# EasyEDA Pro project 一键买弹 pcb.epro

# Schematic Schematic1
Assembly Variant: Basic; Board Name: Board1; Create Date: 2026-06-05; Page Name: P1; Project Name: Custom Keyboard; Schematic Name: Schematic1; Update Date: 2026-06-05; Company: 嘉立创EDA; Page Size: A4; Version: V1.0
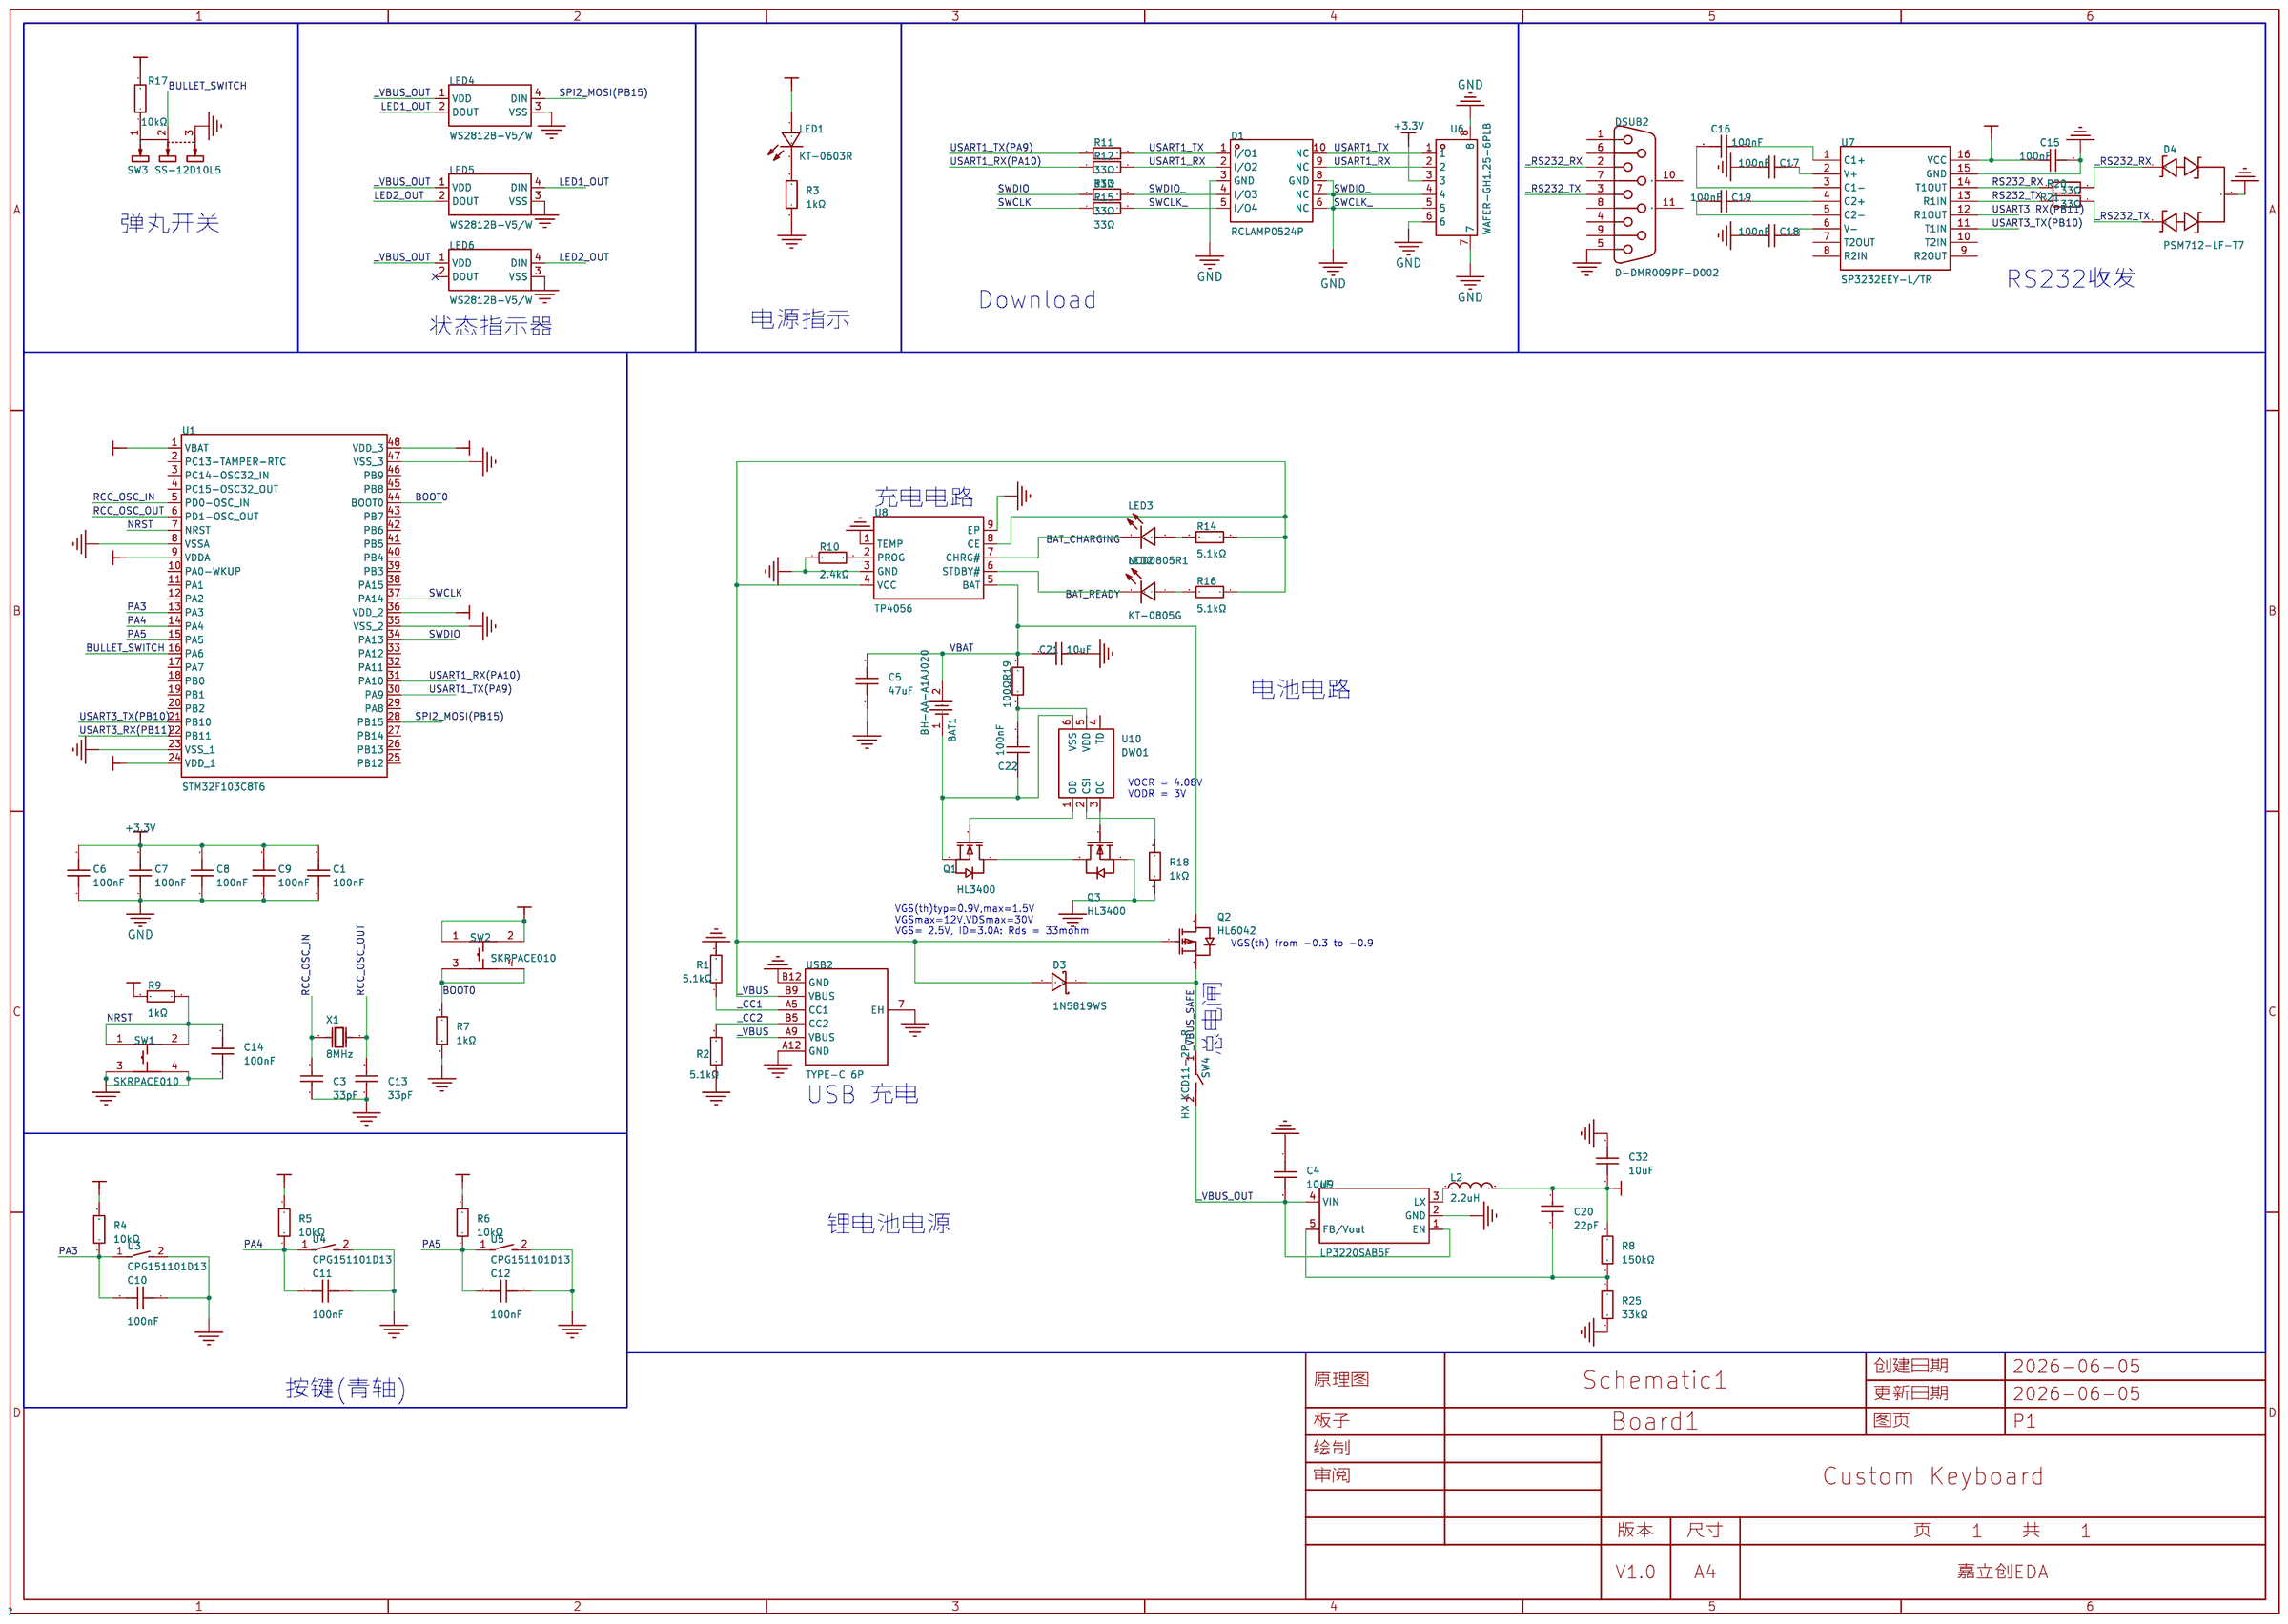
[diagram p0: schematic sheet]

## Parts
BAT1  BH-AA-A1AJ020  [BAT-TH_L56.3-W16.8-P51.55_BH-AA-A1AJ020]
C1  100nF  [C0603]
C3  33pF  [C0603]
C4  10uF  [C0603]
C5  47uF  [C1206]
C6  100nF  [C0603]
C7  100nF  [C0603]
C8  100nF  [C0603]
C9  100nF  [C0603]
C10  100nF  [C0603]
C11  100nF  [C0603]
C12  100nF  [C0603]
C13  33pF  [C0603]
C14  100nF  [C0603]
C15  100nF  [C0603]
C16  100nF  [C0603]
C17  100nF  [C0603]
C18  100nF  [C0603]
C19  100nF  [C0603]
C20  22pF  [C0603]
C21  10uF  [C0603]
C22  100nF  [C0603]
C32  10uF  [C0603]
D1  RCLAMP0524P  [DFN2510-10_L2.5-W1.0-P0.50-BL]
D3  1N5819WS  [SOD-323_L1.8-W1.3-LS2.5-RD]
D4  PSM712-LF-T7  [SOT-23-3_L3.0-W1.7-P0.95-LS2.9-BR]
DSUB2  D-DMR009PF-D002  [DSUB-TH_DMR-9S]
L2  2.2uH  [IND-SMD_L2.5-W2.0_MHCHL2520]
LED1  KT-0603R  [LED-SMD_L1.6-W0.8-R-RD]
LED2  KT-0805G  [LED0805-R-RD]
LED3  NCD0805R1  [LED0805-RD]
LED4  WS2812B-V5/W  [LED-SMD_4P-L5.0-W5.0-TL-1]
LED5  WS2812B-V5/W  [LED-SMD_4P-L5.0-W5.0-TL-1]
LED6  WS2812B-V5/W  [LED-SMD_4P-L5.0-W5.0-TL-1]
Q1  HL3400  [SOT-23-3_L2.9-W1.3-P1.90-LS2.4-BR]
Q2  HL6042  [SOT-23-3_L2.9-W1.4-P1.90-LS2.5-BR]
Q3  HL3400  [SOT-23-3_L2.9-W1.3-P1.90-LS2.4-BR]
R1  5.1kΩ  [R0603]
R2  5.1kΩ  [R0603]
R3  1kΩ  [R0603]
R4  10kΩ  [R0603]
R5  10kΩ  [R0603]
R6  10kΩ  [R0603]
R7  1kΩ  [R0603]
R8  150kΩ  [R0603]
R9  1kΩ  [R0603]
R10  2.4kΩ  [R0603]
R11  33Ω  [R0603]
R12  33Ω  [R0603]
R13  33Ω  [R0603]
R14  5.1kΩ  [R0603]
R15  33Ω  [R0603]
R16  5.1kΩ  [R0603]
R17  10kΩ  [R0603]
R18  1kΩ  [R0603]
R19  100Ω  [R0603]
R20  33Ω  [R0603]
R21  33Ω  [R0603]
R25  33kΩ  [R0603]
SW1  SKRPACE010  [KEY-SMD_4P-L4.2-W3.2-P2.20-LS4.6]
SW2  SKRPACE010  [KEY-SMD_4P-L4.2-W3.2-P2.20-LS4.6]
SW3  SS-12D10L5  [SW-TH_SS-12D10L5]
SW4  HX KCD11-2P-R  [SW-TH_2P-L15.0-W10.5-P5.00_KCD11-2P-R]
U1  STM32F103C8T6  [LQFP-48_L7.0-W7.0-P0.50-LS9.0-BL]
U3  CPG151101D13  [KEY-TH_CPG151101D21X]
U4  CPG151101D13  [KEY-TH_CPG151101D21X]
U5  CPG151101D13  [KEY-TH_CPG151101D21X]
U6  WAFER-GH1.25-6PLB  [CONN-SMD_6P-P1.25_XUNPU_WAFER-GH1.25-6PLB]
U7  SP3232EEY-L/TR  [TSSOP-16_L5.0-W4.4-P0.65-LS6.4-BL]
U8  TP4056  [ESOP-8_L4.9-W3.9-P1.27-LS6.0-BL-EP]
U9  LP3220SAB5F  [SOT-23-5_L3.0-W1.7-P0.95-LS2.8-BR]
U10  DW01  [SOT-23-6_L2.9-W1.6-P0.95-LS2.8-BL]
USB2  TYPE-C 6P  [TYPE-C-SMD_TYPE-C-6P_1]
X1  8MHz  [CRYSTAL-SMD_L5.0-W3.2]

## Library data of the parts
BAT1 = BH-AA-A1AJ020: 加长脚; LCSC Part Name: MYOUNG(美阳)电池盒BH-AA-1J 加长脚DIP 适配5号电池; Supplier Part: C5290181; Manufacturer: MYOUNG(美阳); JLCPCB Part Class: Extended Part; Datasheet: https://item.szlcsc.com/datasheet/BH-AA-A1AJ020/6030887.html; Supplier: LCSC; Type: 电池盒; Operating Temperature: -10~80℃; Contact coating: 镀镍; Applicable battery specifications: 5号
C1 C6-C9 = CC0603KRX7R9BB104: 容值:100nF;精度:±10%;额定电压:50V;材质(温度系数):X7R;; LCSC Part Name: 100nF ±10% 50V; Supplier Part: C14663; Manufacturer: YAGEO(国巨); Supplier Footprint: 0603; JLCPCB Part Class: Basic Part; Datasheet: https://atta.szlcsc.com/upload/public/pdf/source/20180910/C282072_33301C7F631E79921B82A8DAC6BCC5B3.pdf; Supplier: LCSC; Tolerance: ±10%; Voltage Rating: 50V; Temperature Coefficient: X7R; Voltage Rated: 50V
C3 C13 = CL10C330JB8NNNC: 容值:33pF;精度:±5%;额定电压:50V;温度系数:C0G;; LCSC Part Name: 33pF ±5% 50V; Supplier Part: C1663; Manufacturer: SAMSUNG(三星); Supplier Footprint: 0603; JLCPCB Part Class: Basic Part; Datasheet: https://item.szlcsc.com/datasheet/CL10C330JB8NNNC/2015.html; Supplier: LCSC; Tolerance: ±5%; Voltage Rating: 50V; Temperature Coefficient: C0G
C4 C32 = CL10A106MA8NRNC: 容值:10uF;精度:±20%;额定电压:25V;温度系数:X5R;; LCSC Part Name: 10uF ±20% 25V; Supplier Part: C96446; Manufacturer: SAMSUNG(三星); Supplier Footprint: 0603; JLCPCB Part Class: Basic Part; Datasheet: https://item.szlcsc.com/datasheet/CL10A106MA8NRNC/97651.html; Supplier: LCSC; Tolerance: ±20%; Voltage Rating: 25V; Temperature Coefficient: X5R
C5 = CL31A476MPHNNNE: 容值:47uF;精度:±20%;额定电压:10V;温度系数:X5R;; LCSC Part Name: 47uF ±20% 10V; Supplier Part: C96123; Manufacturer: SAMSUNG(三星); Supplier Footprint: 1206; JLCPCB Part Class: Basic Part; Datasheet: https://item.szlcsc.com/datasheet/CL31A476MPHNNNE/97327.html; Supplier: LCSC; Tolerance: ±20%; Voltage Rating: 10V; Temperature Coefficient: X5R
C10-C12 C14-C19 C22 = CC0603KRX7R9BB104: 容值:100nF;精度:±10%;额定电压:50V;温度系数:X7R;; LCSC Part Name: 100nF ±10% 50V; Supplier Part: C14663; Manufacturer: YAGEO(国巨); Supplier Footprint: 0603; JLCPCB Part Class: Basic Part; Datasheet: https://item.szlcsc.com/datasheet/CC0603KRX7R9BB104/15331.html; Supplier: LCSC; Tolerance: ±10%; Voltage Rating: 50V; Temperature Coefficient: X7R
C20 = CL10C220JB8NNNC: 容值:22pF;精度:±5%;额定电压:50V;温度系数:C0G;; LCSC Part Name: 22pF ±5% 50V; Supplier Part: C1653; Manufacturer: SAMSUNG(三星); Supplier Footprint: 0603; JLCPCB Part Class: Basic Part; Datasheet: https://item.szlcsc.com/datasheet/CL10C220JB8NNNC/2005.html; Supplier: LCSC; Tolerance: ±5%; Voltage Rating: 50V; Temperature Coefficient: C0G
C21 = CL10A106KP8NNNC: 容值:10uF;精度:±10%;额定电压:10V;温度系数:X5R;; LCSC Part Name: 10uF ±10% 10V; Supplier Part: C19702; Manufacturer: SAMSUNG(三星); Supplier Footprint: 0603; JLCPCB Part Class: Basic Part; Datasheet: https://item.szlcsc.com/datasheet/CL10A106KP8NNNC/20411.html; Supplier: LCSC; Tolerance: ±10%; Voltage Rating: 10V; Temperature Coefficient: X5R
D1 = RCLAMP0524P_C907837: 极性:单向;反向截止电压(Vrwm):5V;最大钳位电压:17V;峰值脉冲电流(Ipp):4.5A;击穿电压:6.8V;; Supplier Part: C907837; Manufacturer: TECH PUBLIC(台舟); Supplier Footprint: DFN2510-10; JLCPCB Part Class: 扩展库; Datasheet: https://atta.szlcsc.com/upload/public/pdf/source/20210810/AE3DE9AC94AD2A317FD9BEA10653400F.pdf; Supplier: LCSC; polarity: 单向; Reverse Stand-Off Voltage (Vrwm): 5V; Maximum Clamping Voltage: 17V; Peak Pulse Current (Ipp): 4.5A; Breakdown Voltage: 6.8V; Reverse Leakage Current (Ir): 80nA; Number of Lines: 四路; Operating Temperature: -55℃~+125℃; level of protection: IEC 61000-4-2; Type: ESD
D3 = 1N5819WS_C191023: 正向压降(Vf):600mV@1A;直流反向耐压(Vr):40V;整流电流:1A;; LCSC Part Name: 电压:40V 电流:1A; Supplier Part: C191023; Manufacturer: Hottech(合科泰); Supplier Footprint: SOD-323; JLCPCB Part Class: Basic Part; Datasheet: https://item.szlcsc.com/datasheet/1N5819WS/213850.html; Supplier: LCSC; Voltage - Forward(Vf@If): 600mV@1A; Voltage - DC Reverse(Vr): 40V; Current - Rectified: 1A; Non-Repetitive Peak Forward Surge Current: 25A
D4 = PSM712-LF-T7: 极性:单向;反向截止电压(Vrwm):12V;钳位电压:19V;峰值脉冲电流(Ipp):34A@8/20us；30A@8/20us;峰值脉冲功率(Ppp):600W@8/20us;击穿电压(VBR):13.3V;; LCSC Part Name: 单向TVS 12V截止 峰值浪涌电流：34A@8/20us 30A@8/20us; Supplier Part: C32677; Manufacturer: PROTEK; Supplier Footprint: SOT-23; JLCPCB Part Class: Basic Part; Datasheet: https://item.szlcsc.com/datasheet/PSM712-LF-T7/33642.html; Supplier: LCSC; Polarity: 单向; Reverse Stand-Off Voltage (Vrwm): 12V; Clamping Voltage: 19V; Peak Pulse Current (Ipp): 34A@8/20us；30A@8/20us; Peak Pulse Power Dissipation (Ppp): 600W@8/20us; Voltage - Breakdown: 13.3V; Reverse Leakage Current (Ir): 1uA；20uA; Operating Temperature: -55℃~+150℃; level of protection: IEC 61000-4-4；IEC 61000-4-5；IEC 61000-4-2; Type: TVS; Junction Capacitance: 75pF
DSUB2 = D-DMR009PF-D002: 连接器类型:常规D-Sub;公母:母;总PIN位数:9P;安装方式:弯插;排数:2;额定电流-信号脚:3A;工作温度:-45℃~+85℃;; LCSC Part Name: DMR9母; Supplier Part: C141882; Manufacturer: Ckmtw(灿科盟); Supplier Footprint: 弯插; JLCPCB Part Class: Extended Part; Datasheet: https://item.szlcsc.com/datasheet/D-DMR009PF-D002/153213.html; Supplier: LCSC; Connector Type: 常规D-Sub; Gender: 母; Number of Pins: 9P; Mounting Type: 弯插; Number of Rows: 2; Current Rating-Signal: 3A; Color: 黑色; Operating Temperature: -45℃~+85℃
L2 = FTC252012S2R2MBCA: 电感值:2.2uH;精度:±20%;额定电流:3A;饱和电流(Isat):3.8A;类型:一体成型电感;; LCSC Part Name: 2.2uH ±20% 3.8A; Supplier Part: C5832372; Manufacturer: cjiang(长江微电); Supplier Footprint: 1008; JLCPCB Part Class: Extended Part; Datasheet: https://atta.szlcsc.com/upload/public/pdf/source/20230602/8FFEDA9C0247A92A0D4B67554BFE4091.pdf; Supplier: LCSC; Tolerance: ±20%; Rated Current: 3A; Saturation Current (Isat): 3.8A; DC Resistance (DCR): 55mΩ; Type: 一体成型电感
LED1 = KT-0603R: 灯头类型:-;发光颜色:红色;正向压降(Vf):1.8V~2.4V;功率:40mW;正向电流:20mA;波长:615nm~630nm;二极管配置:独立二极管;透镜颜色:无色透明透镜;色温:-;发光强度:300mcd;发光角度:120°;载带方式:-;工作温度:-40℃~+85℃;; LCSC Part Name: 0603 红灯 高亮; Supplier Part: C2286; Manufacturer: KENTO; Supplier Footprint: 0603; JLCPCB Part Class: Basic Part; Datasheet: https://item.szlcsc.com/datasheet/KT-0603R/2659.html; Supplier: LCSC; Illumination Color: 红色; Voltage - Forward(Vf): 1.8V~2.4V; Power(Watts): 40mW; Forward Current: 20mA; Wavelength - Dominant: 615nm~630nm; Peak Wavelength: 645nm; Diode Configuration: 独立二极管; Lens Color: 无色透明透镜; Luminous Intensity: 300mcd; Viewing Angle: 120°; Operating Temperature: -40℃~+85℃
LED2 = KT-0805G: 灯头类型:2mmx1.25mm方形灯头;发光颜色:翠绿色;正向压降(Vf):2.6V~3.1V;功率:100mW;正向电流:5mA;波长:513nm~528nm;二极管配置:独立二极管;透镜颜色:无色透明透镜;色温:-;发光强度:430mcd;发光角度:120°;载带方式:-;工作温度:-40℃~+85℃;; LCSC Part Name: 0805 翠绿 高亮; Supplier Part: C2297; Manufacturer: KENTO; Supplier Footprint: 0805; JLCPCB Part Class: Basic Part; Datasheet: https://item.szlcsc.com/datasheet/KT-0805G/2670.html; Supplier: LCSC; Lamp Holder Type: 2mmx1.25mm方形灯头; Illumination Color: 翠绿色; Voltage - Forward(Vf): 2.6V~3.1V; Power(Watts): 100mW; Forward Current: 5mA; Wavelength - Dominant: 513nm~528nm; Peak Wavelength: 525nm; Diode Configuration: 独立二极管; Lens Color: 无色透明透镜; Luminous Intensity: 430mcd; Viewing Angle: 120°; Operating Temperature: -40℃~+85℃
LED3 = NCD0805R1: 灯头类型:-;发光颜色:红色;正向压降(Vf):1.6V~2.6V;功率:65mW;正向电流:25mA;波长:615nm~630nm;二极管配置:独立二极管;透镜颜色:-;色温:-;发光强度:195mcd;发光角度:130°;载带方式:-;工作温度:-30℃~+85℃;; LCSC Part Name: 片式发光二极管; Supplier Part: C84256; Manufacturer: 国星光电; Supplier Footprint: 0805; JLCPCB Part Class: Basic Part; Datasheet: https://item.szlcsc.com/datasheet/NCD0805R1/85425.html; Supplier: LCSC; Illumination Color: 红色; Voltage - Forward(Vf): 1.6V~2.6V; Power(Watts): 65mW; Forward Current: 25mA; Wavelength - Dominant: 615nm~630nm; Peak Wavelength: 630nm; Diode Configuration: 独立二极管; Luminous Intensity: 195mcd; Viewing Angle: 130°; Operating Temperature: -30℃~+85℃
LED4-LED6 = WS2812B-V5/W: 无需外围元器件，有反接保护和过压保护，游乐设备，消费类电子，电竞领域，电脑周边及设备; LCSC Part Name: RGB三色; Supplier Part: C2874885; Manufacturer: worldsemi; Supplier Footprint: SMD5050; JLCPCB Part Class: Extended Part; Datasheet: https://atta.szlcsc.com/upload/public/pdf/source/20241202/615CE05766148E9C4DD7D8CE8DBC7337.pdf; Supplier: LCSC
Q1 Q3 = HL3400: 数量:1个N沟道;漏源电压(Vdss):30V;连续漏极电流(Id):5.6A;导通电阻(RDS(on)):21mΩ@10V；33mΩ@2.5V；25mΩ@4.5V;耗散功率(Pd):1.2W;阈值电压(Vgs(th)):900mV@250uA;; LCSC Part Name: N-通道,电流:5.6A,耐压:30V; Supplier Part: C22469448; Manufacturer: R+O(宏嘉诚); Supplier Footprint: SOT-23; JLCPCB Part Class: Extended Part; Datasheet: https://item.szlcsc.com/datasheet/HL3400/24180419.html; Supplier: LCSC; Number: 1个N沟道; Drain to Source Voltage: 30V; Current - Continuous Drain(Id): 5.6A; RDS(on): 21mΩ@10V；33mΩ@2.5V；25mΩ@4.5V; Pd - Power Dissipation: 1.2W; Gate Threshold Voltage (Vgs(th)): 900mV@250uA; Gate Charge(Qg): 17nC@10V; Input Capacitance(Ciss): 630pF; Reverse Transfer Capacitance (Crss@Vds): 71pF; Operating Temperature: -55℃~+150℃; Type: N沟道; Output Capacitance(Coss): 90pF
Q2 = HL6042: 数量:1个P沟道;漏源电压(Vdss):20V;连续漏极电流(Id):5A;导通电阻(RDS(on)):43mΩ@4.5V;耗散功率(Pd):1.5W;阈值电压(Vgs(th)):900mV@250uA;; LCSC Part Name: 1个P沟道 耐压:20V 电流:5A; Supplier Part: C28646264; Manufacturer: R+O(宏嘉诚); Supplier Footprint: SOT-23; JLCPCB Part Class: Extended Part; Datasheet: https://item.szlcsc.com/datasheet/HL6042/30381010.html; Supplier: LCSC; Number: 1个P沟道; Drain to Source Voltage: 20V; Current - Continuous Drain(Id): 5A; RDS(on): 43mΩ@4.5V; Pd - Power Dissipation: 1.5W; Gate Threshold Voltage (Vgs(th)): 900mV@250uA; Gate Charge(Qg): 11nC@4.5V; Input Capacitance(Ciss): 905pF; Reverse Transfer Capacitance (Crss@Vds): 115pF; Operating Temperature: -55℃~+150℃; Type: P沟道; Output Capacitance(Coss): 150pF
R1 R2 R14 R16 = 0603WAF5101T5E: 电阻类型:厚膜电阻;阻值:5.1kΩ;精度:±1%;功率:100mW;工作电压:75V;温度系数:±100ppm/℃;; LCSC Part Name: 5.1kΩ ±1% 100mW 厚膜电阻; Supplier Part: C23186; Manufacturer: UNI-ROYAL(厚声); Supplier Footprint: 0603; JLCPCB Part Class: Basic Part; Datasheet: https://item.szlcsc.com/datasheet/0603WAF5101T5E/23913.html; Supplier: LCSC; Type: 厚膜电阻; Tolerance: ±1%; Power(Watts): 100mW; Voltage-Supply(Max): 75V; Temperature Coefficient: ±100ppm/℃; Operating Temperature: -55℃~+155℃
R3 R7 R9 R18 = 0603WAF1001T5E: 电阻类型:厚膜电阻;阻值:1kΩ;精度:±1%;功率:100mW;最大工作电压:75V;温度系数:±100ppm/℃;; LCSC Part Name: 1kΩ ±1% 100mW 厚膜电阻; Supplier Part: C21190; Manufacturer: UNI-ROYAL(厚声); Supplier Footprint: 0603; JLCPCB Part Class: Basic Part; Datasheet: https://atta.szlcsc.com/upload/public/pdf/source/20200306/C422600_1E6D84923E4A46A82E41ADD87F860B5C.pdf; Supplier: LCSC; Type: 厚膜电阻; Tolerance: ±1%; Power(Watts): 100mW; Overload Voltage (Max): 75V; Temperature Coefficient: ±100ppm/℃; Operating Temperature Range: -55℃~+155℃
R4-R6 R17 = 0603WAF1002T5E: 电阻类型:厚膜电阻;阻值:10kΩ;精度:±1%;功率:100mW;工作电压:75V;温度系数:±100ppm/℃;; LCSC Part Name: 厚膜电阻 10kΩ ±1% 100mW; Supplier Part: C25804; Manufacturer: UNI-ROYAL(厚声); Supplier Footprint: 0603; JLCPCB Part Class: Basic Part; Datasheet: https://item.szlcsc.com/datasheet/0603WAF1002T5E/26547.html; Supplier: LCSC; Type: 厚膜电阻; Tolerance: ±1%; Power(Watts): 100mW; Voltage-Supply(Max): 75V; Temperature Coefficient: ±100ppm/℃; Operating Temperature: -55℃~+155℃
R8 = 0603WAF1503T5E: 电阻类型:厚膜电阻;阻值:150kΩ;精度:±1%;功率:100mW;工作电压:75V;温度系数:±100ppm/℃;; LCSC Part Name: 150kΩ ±1% 100mW 厚膜电阻; Supplier Part: C22807; Manufacturer: UNI-ROYAL(厚声); Supplier Footprint: 0603; JLCPCB Part Class: Basic Part; Datasheet: https://item.szlcsc.com/datasheet/0603WAF1503T5E/23534.html; Supplier: LCSC; Type: 厚膜电阻; Tolerance: ±1%; Power(Watts): 100mW; Voltage-Supply(Max): 75V; Temperature Coefficient: ±100ppm/℃; Operating Temperature: -55℃~+155℃
R10 = 0603WAF2401T5E: 电阻类型:厚膜电阻;阻值:2.4kΩ;精度:±1%;功率:100mW;工作电压:75V;温度系数:±100ppm/℃;; LCSC Part Name: 2.4kΩ ±1% 100mW 厚膜电阻; Supplier Part: C22940; Manufacturer: UNI-ROYAL(厚声); Supplier Footprint: 0603; JLCPCB Part Class: Basic Part; Datasheet: https://item.szlcsc.com/datasheet/0603WAF2401T5E/23667.html; Supplier: LCSC; Type: 厚膜电阻; Tolerance: ±1%; Power(Watts): 100mW; Voltage-Supply(Max): 75V; Temperature Coefficient: ±100ppm/℃; Operating Temperature: -55℃~+155℃
R11-R13 R15 R20 R21 = 0603WAF330JT5E: 电阻类型:厚膜电阻;阻值:33Ω;精度:±1%;功率:100mW;工作电压:75V;温度系数:±100ppm/℃;; LCSC Part Name: 33Ω ±1% 100mW 厚膜电阻; Supplier Part: C23140; Manufacturer: UNI-ROYAL(厚声); Supplier Footprint: 0603; JLCPCB Part Class: Basic Part; Datasheet: https://item.szlcsc.com/datasheet/0603WAF330JT5E/23867.html; Supplier: LCSC; Type: 厚膜电阻; Tolerance: ±1%; Power(Watts): 100mW; Voltage-Supply(Max): 75V; Temperature Coefficient: ±100ppm/℃; Operating Temperature: -55℃~+155℃
R19 = 0603WAF1000T5E: 电阻类型:厚膜电阻;阻值:100Ω;精度:±1%;功率:100mW;最大工作电压:75V;温度系数:±200ppm/℃;; LCSC Part Name: 100Ω ±1% 100mW 厚膜电阻; Supplier Part: C22775; Manufacturer: UNI-ROYAL(厚声); Supplier Footprint: 0603; JLCPCB Part Class: Basic Part; Datasheet: https://atta.szlcsc.com/upload/public/pdf/source/20200306/C422600_1E6D84923E4A46A82E41ADD87F860B5C.pdf; Supplier: LCSC; Type: 厚膜电阻; Tolerance: ±1%; Power(Watts): 100mW; Overload Voltage (Max): 75V; Temperature Coefficient: ±200ppm/℃; Operating Temperature Range: -55℃~+155℃
R25 = 0603WAF3302T5E: 电阻类型:厚膜电阻;阻值:33kΩ;精度:±1%;功率:100mW;工作电压:75V;温度系数:±100ppm/℃;; LCSC Part Name: 33kΩ ±1% 100mW 厚膜电阻; Supplier Part: C4216; Manufacturer: UNI-ROYAL(厚声); Supplier Footprint: 0603; JLCPCB Part Class: Basic Part; Datasheet: https://item.szlcsc.com/datasheet/0603WAF3302T5E/4623.html; Supplier: LCSC; Type: 厚膜电阻; Tolerance: ±1%; Power(Watts): 100mW; Voltage-Supply(Max): 75V; Temperature Coefficient: ±100ppm/℃; Operating Temperature: -55℃~+155℃
SW1 SW2 = SKRPACE010: 电路结构:单刀单掷;按钮形状:椭圆形按钮;安装方式:立贴;开关长度:4.2mm;开关宽度:3.2mm;开关高度:2.5mm;触点电流:50mA;额定电压:16V;带灯:-;工作寿命:-;; LCSC Part Name: 4.2*3.2*2.5mm 立贴 轻触开关; Supplier Part: C139797; Manufacturer: ALPSALPINE(阿尔卑斯阿尔派); Supplier Footprint: SMD-4P,4.2x3.2mm; JLCPCB Part Class: Extended Part; Datasheet: https://item.szlcsc.com/datasheet/SKRPACE010/151122.html; Supplier: LCSC; Circuit: 单刀单掷; Actuator Style: 椭圆形按钮; Mounting Type: 立贴; Length: 4.2mm; Width: 3.2mm; Switch Height: 2.5mm; Contact Current: 50mA; Voltage Rating: 16V
SW3 = SS-12D10L5: 电路结构:单刀双掷;安装方式:直插;开关颜色:黑色;额定电流:3A;额定电压:125V;工作寿命:1万次;; LCSC Part Name: 柄长5mm 直插双档 滑动开关; Supplier Part: C319012; Manufacturer: XKB Connection(中国星坤); Supplier Footprint: 插件,13x6.8mm; JLCPCB Part Class: Extended Part; Datasheet: https://item.szlcsc.com/datasheet/SS-12D10L5/300104.html; Supplier: LCSC; Circuit: 单刀双掷; Actuator Style: 矩形柱状; Termination Style: PC引脚; Length: 13mm; Width: 6.8mm; Switch Height: 6.4mm; Mounting Type: 直插; Actuator Color: 黑色; Current Rating: 3A; Voltage Rating: 125V; Life: 1万次; Operating Temperature: -40℃~+85℃
SW4 = HX KCD11-2P-R: 带灯:无;引脚样式:焊片;额定电流:3A;额定电压(AC):250V;电路结构:单刀单掷;工作寿命:1万次;; LCSC Part Name: 10.5*15mm 两脚两档跷板开关 红钮; Supplier Part: C6917318; Manufacturer: hanxia(韩下); Supplier Footprint: 插件; JLCPCB Part Class: Extended Part; Datasheet: https://item.szlcsc.com/datasheet/HX%2520KCD11-2P-R/7881930.html; Supplier: LCSC; With Lamp: 无; Termination Style: 焊片; Actuator Color: 红色; Current Rating: 3A; Voltage Rating (AC): 250V; Circuit: 单刀单掷; Life: 1万次
U1 = STM32F103C8T6: CPU内核:ARM-M3;CPU最大主频:72MHz;应用领域:-;; LCSC Part Name: 主流增强型ARM Cortex-M3 MCU，具有64 KB Flash、72 MHz CPU、电机控制、USB和CAN; Supplier Part: C8734; Manufacturer: ST(意法半导体); Supplier Footprint: LQFP-48(7x7); JLCPCB Part Class: Extended Part; Datasheet: https://item.szlcsc.com/datasheet/STM32F103C8T6/9243.html; Supplier: LCSC; CPU Core: ARM-M3; CPU Maximum Speed: 72MHz; Program Storage Size: 64KB; Program Memory Type: FLASH; Number of I/O: 37; ADC (Bit): 12bit; Voltage - Supply: 2V~3.6V
U3-U5 = CPG151101D13: 轴类型:青轴;作用力:50gf;; LCSC Part Name: 青轴; Supplier Part: C49234235; Manufacturer: HanElectricity(瀚源); Supplier Footprint: 插件; JLCPCB Part Class: Extended Part; Datasheet: https://item.szlcsc.com/datasheet/CPG151101D13/51650377.html; Supplier: LCSC; Axis Type: 青轴; Operation Force: 50gf; Conduction Travel: 2.2mm; Voltage Rating: 12V; Operating Temperature: -40℃~+70℃
U6 = WAFER-GH1.25-6PLB: 插针结构:1x6P;间距:1.25mm;安装方式:立贴;参考系列:GH;总PIN数:6P;排数:1;每排PIN数:6;额定电流:1A;工作温度范围:-25℃~+85℃;; LCSC Part Name: 1x6P 间距:1.25mm 立贴 系列:GH; Supplier Part: C3029372; Manufacturer: XUNPU(讯普); Supplier Footprint: SMD,P=1.25mm; JLCPCB Part Class: 扩展库; Datasheet: https://atta.szlcsc.com/upload/public/pdf/source/20220527/44F824AAC8C2B617205E15955FF9C23D.pdf; Supplier: LCSC; Pins Structure: 1x6P; Pitch: 1.25mm; Mounting Style: 立贴; Reference Series: GH; Number of Pins: 6P; Number of Rows: 1; Number of PINs Per Row: 6; Current Rating (Max): 1A; Operating Temperature Range: -25℃~+85℃
U7 = SP3232EEY-L/TR: 类型:收发器;数据速率:235Kbps;; LCSC Part Name: True3.0V至5.5V RS-232收发器; Supplier Part: C13482; Manufacturer: MaxLinear(迈凌); Supplier Footprint: TSSOP-16; JLCPCB Part Class: Basic Part; Datasheet: https://item.szlcsc.com/datasheet/SP3232EEY-L%252FTR/14131.html; Supplier: LCSC; Type: 收发器; Number of Drivers: 2; Number of Receivers: 2; Data Rate: 235Kbps; Voltage - Supply: 3V~5.5V; ESD Protect: ±15kV; charge pump: 有; Operating Temperature: -40℃~+85℃
U8 = TP4056_C725790: 工作电压:4V~6.5V;最大充电电流:1A;电池类型:锂电池;电池节数:1;; LCSC Part Name: 1A独立式线性锂离子电池充电器; Supplier Part: C725790; Manufacturer: UMW(友台半导体); Supplier Footprint: ESOP-8; JLCPCB Part Class: Extended Part; Datasheet: https://item.szlcsc.com/datasheet/TP4056/772193.html; Supplier: LCSC; The Chip Type: 充电芯片; Voltage - Supply: 4V~6.5V; Charge Current - Max: 1A; Charging Saturation Voltage: 4.2V; Type of Battery: 锂电池; Number of Cells: 1; Operating Temperature: -40℃~+85℃; Battery Temperature Detection: 支持; 0V Battery Charge: 支持; Supply Current (Iq): 35uA; Features: 恒压充电；恒流充电；自动再充电；充电终止；软启动；可编程充电电流；欠压锁定；涓流充电
U9 = LP3220SAB5F: 功能类型:降压型;工作电压:2.2V~5.5V;输出电压:610mV~5.5V;输出电流:1A;输出类型:可调;; LCSC Part Name: 降压型 1A 2.2V~5.5V; Supplier Part: C517212; Manufacturer: LOWPOWER(微源半导体); Supplier Footprint: SOT-23-5; JLCPCB Part Class: Extended Part; Datasheet: https://item.szlcsc.com/datasheet/LP3220SAB5F/533577.html; Supplier: LCSC; Function: 降压型; Voltage - Supply: 2.2V~5.5V; Output Voltage: 610mV~5.5V; Output Current: 1A; Frequency - Switching: 1.5MHz; Operating Temperature: -40℃~+85℃@(TA); Synchronous Rectifier: 是; Number of Outputs: 1; Topology: 降压式; Quiescent Current: 70uA; Switch tube (built-in/external): 内置; Output Type: 可调; Features: 逐波限流；过流保护
U10 = DW01_C917079: 工作电压:1.5V~8V;最大充电电流:-;电池类型:锂电池;电池节数:1;; LCSC Part Name: 锂离子/锂聚合物电池保护IC; Supplier Part: C917079; Manufacturer: JSMSEMI(杰盛微); Supplier Footprint: SOT-23-6; JLCPCB Part Class: Extended Part; Datasheet: https://item.szlcsc.com/datasheet/DW01/991575.html; Supplier: LCSC; The Chip Type: 保护芯片; Voltage - Supply: 1.5V~8V; Charging Saturation Voltage: 4.28V; End-Off Voltage: 2.4V; Type of Battery: 锂电池; Number of Cells: 1; Operating Temperature: -40℃~+85℃; Battery Temperature Detection: 不支持; 0V Battery Charge: 支持; Supply Current (Iq): 4uA
USB2 = TYPE-C 6P: 连接器类型:Type-C;协议标准:-;公母:母;安装方式:卧贴;触点数量:6P;端口数量:1;额定电流 - 电源:3A;工作温度:-40℃~+85℃;; LCSC Part Name: 6P卧贴母座; Supplier Part: C456012; Manufacturer: SHOU HAN(首韩); Supplier Footprint: SMD; JLCPCB Part Class: Extended Part; Datasheet: https://item.szlcsc.com/datasheet/TYPE-C%25206P/458819.html; Supplier: LCSC; Connector Type: Type-C; Gender: 母; Mounting Type: 卧贴; Number of Contacts: 6P; Number of Ports: 1; Current Rating-Power: 3A; Voltage Rating: 5V; Connect-Disconnect Life: 3千次; Detection color: 黑色; Operating Temperature: -40℃~+85℃
X1 = X50328MSB2GI: 晶振类型:贴片晶振;频率:8MHz;常温频差:±10ppm;负载电容:20pF;频率稳定度:±20ppm;; LCSC Part Name: YSX530GA 8MHZ 2P 5032 20PF ±10PPM -40~85℃ (±20PPM); Supplier Part: C115962; Manufacturer: YXC(扬兴晶振); Supplier Footprint: SMD5032-2P; JLCPCB Part Class: Basic Part; Datasheet: https://item.szlcsc.com/datasheet/X50328MSB2GI/117214.html; Supplier: LCSC; Type: 贴片晶振; Normal temperature Frequency Tolerance: ±10ppm; Load Capacitance: 20pF; Frequency Stability: ±20ppm; Operating Temperature: -40℃~+85℃

## Nets
+3.3V: C1.2 C6.2 C7.2 C8.2 C9.2 C15.1 C20.1 C32.2 L2.2 LED1.1(A) R4.2 R5.2 R6.2 R8.1 R9.2 R17.2 SW2.1 SW2.2 U1.1(VBAT) U1.9(VDDA) U1.24(VDD_1) U1.36(VDD_2) U1.48(VDD_3) U6.3 U7.16(VCC)
GND: C1.1 C3.1 C4.1 C5.1 C6.1 C7.1 C8.1 C9.1 C10.1 C11.1 C12.1 C13.1 C14.1 C15.2 C17.1 C18.1 C21.1 C32.1 D1.3(GND) D1.8(GND) D4.3(K) DSUB2.5 LED4.3(VSS) LED5.3(VSS) LED6.3(VSS) Q3.2(S) R1.2 R2.1 R3.1 R7.2 R10.1 R18.1 R25.2 SW1.3 SW1.4 SW3.3 U1.8(VSSA) U1.23(VSS_1) U1.35(VSS_2) U1.47(VSS_3) U3.2 U4.2 U5.2 U6.6 U6.7 U6.8 U7.15(GND) U8.1(TEMP) U8.3(GND) U8.9(EP) U9.2(GND) USB2.7(EH) USB2.A12(GND) USB2.B12(GND)
VBAT: BAT1.2 C5.2 C21.2 Q2.3(D) R19.1 U8.5(BAT)
_CC1: R1.1 USB2.A5(CC1)
_CC2: R2.2 USB2.B5(CC2)
_RS232_RX: D4.1(A1) DSUB2.2 R20.2
_RS232_TX: D4.2(A1) DSUB2.3 R21.2
_VBUS: D3.2(A) Q2.1(G) R14.1 R16.1 U8.4(VCC) U8.8(CE) USB2.A9(VBUS) USB2.B9(VBUS)
_VBUS_OUT: C4.2 LED4.1(VDD) LED5.1(VDD) LED6.1(VDD) SW4.2 U9.1(EN) U9.4(VIN)
_VBUS_SAFE: D3.1(K) Q2.2(S) SW4.1
BAT_CHARGING: LED3.1(-) U8.7(CHRG#)
BAT_READY: LED2.2(K) U8.6(STDBY#)
BOOT0: R7.1 SW2.3 SW2.4 U1.44(BOOT0)
BULLET_SWITCH: SW3.2 U1.16(PA6)
LED1_OUT: LED4.2(DOUT) LED5.4(DIN)
LED2_OUT: LED5.2(DOUT) LED6.4(DIN)
NRST: C14.2 R9.1 SW1.1 SW1.2 U1.7(NRST)
PA3: C10.2 R4.1 U1.13(PA3) U3.1
PA4: C11.2 R5.1 U1.14(PA4) U4.1
PA5: C12.2 R6.1 U1.15(PA5) U5.1
RCC_OSC_IN: C3.2 U1.5(PD0-OSC_IN) X1.2(OSC2)
RCC_OSC_OUT: C13.2 U1.6(PD1-OSC_OUT) X1.1(OSC1)
RS232_RX: R20.1 U7.14(T1OUT)
RS232_TX: R21.1 U7.13(R1IN)
SPI2_MOSI(PB15): LED4.4(DIN) U1.28(PB15)
SWCLK: R15.1 U1.37(PA14)
SWCLK_: D1.5(I/O4) D1.6(NC) R15.2 U6.5
SWDIO: R13.1 U1.34(PA13)
SWDIO_: D1.4(I/O3) D1.7(NC) R13.2 U6.4
USART1_RX: D1.2(I/O2) D1.9(NC) R12.2 U6.2
USART1_RX(PA10): R12.1 U1.31(PA10)
USART1_TX: D1.1(I/O1) D1.10(NC) R11.2 U6.1
USART1_TX(PA9): R11.1 U1.30(PA9)
USART3_RX(PB11): U1.22(PB11) U7.12(R1OUT)
USART3_TX(PB10): U1.21(PB10) U7.11(T1IN)
$1N16: LED1.2(K) R3.2
$1N89: C16.1 U7.1(C1+)
$1N90: C16.2 U7.3(C1-)
$1N91: C17.2 U7.2(V+)
$1N93: C18.2 U7.6(V-)
$1N102: C19.2 U7.4(C2+)
$1N103: C19.1 U7.5(C2-)
$1N132: R10.2 U8.2(PROG)
$1N134: LED3.2(+) R14.2
$1N138: LED2.1(A) R16.2
$1N157: R17.1 SW3.1
$1N185: R18.2 U10.2(CSI)
$1N186: Q1.1(G) U10.1(OD)
$1N187: Q3.1(G) U10.3(OC)
$1N188: Q1.3(D) Q3.3(D)
$1N233: L2.1 U9.3(LX)
$1N234: C20.2 R8.2 R25.1 U9.5(FB/Vout)
$1N238: C22.2 R19.2 U10.5(VDD)
$1N240: BAT1.1 C22.1 Q1.2(S) U10.6(VSS)

Not connected (* = marked no-connect by the designer): DSUB2 1 4 6 7 8 9 10(MH1) 11(MH2); LED6 2(DOUT)*; U1 2(PC13-TAMPER-RTC) 3(PC14-OSC32_IN) 4(PC15-OSC32_OUT) 10(PA0-WKUP) 11(PA1) 12(PA2) 17(PA7) 18(PB0) 19(PB1) 20(PB2) 25(PB12) 26(PB13) 27(PB14) 29(PA8) 32(PA11) 33(PA12) 38(PA15) 39(PB3) 40(PB4) 41(PB5) 42(PB6) 43(PB7) 45(PB8) 46(PB9); U7 7(T2OUT) 8(R2IN) 9(R2OUT) 10(T2IN); U10 4(TD)

## Notes on the sheet
- 弹丸开关
- RS232收发
- Download
- 状态指示器
- 电源指示
- 充电电路
- 电池电路
- VOCR = 4.08V
  VODR = 3V
- VGS(th)typ=0.9V,max=1.5V
  VGSmax=12V,VDSmax=30V
  VGS= 2.5V, ID=3.0A: Rds = 33mohm
- VGS(th) from -0.3 to -0.9
- 总电闸
- USB 充电
- 锂电池电源
- 按键(青轴)

# Board PCB1
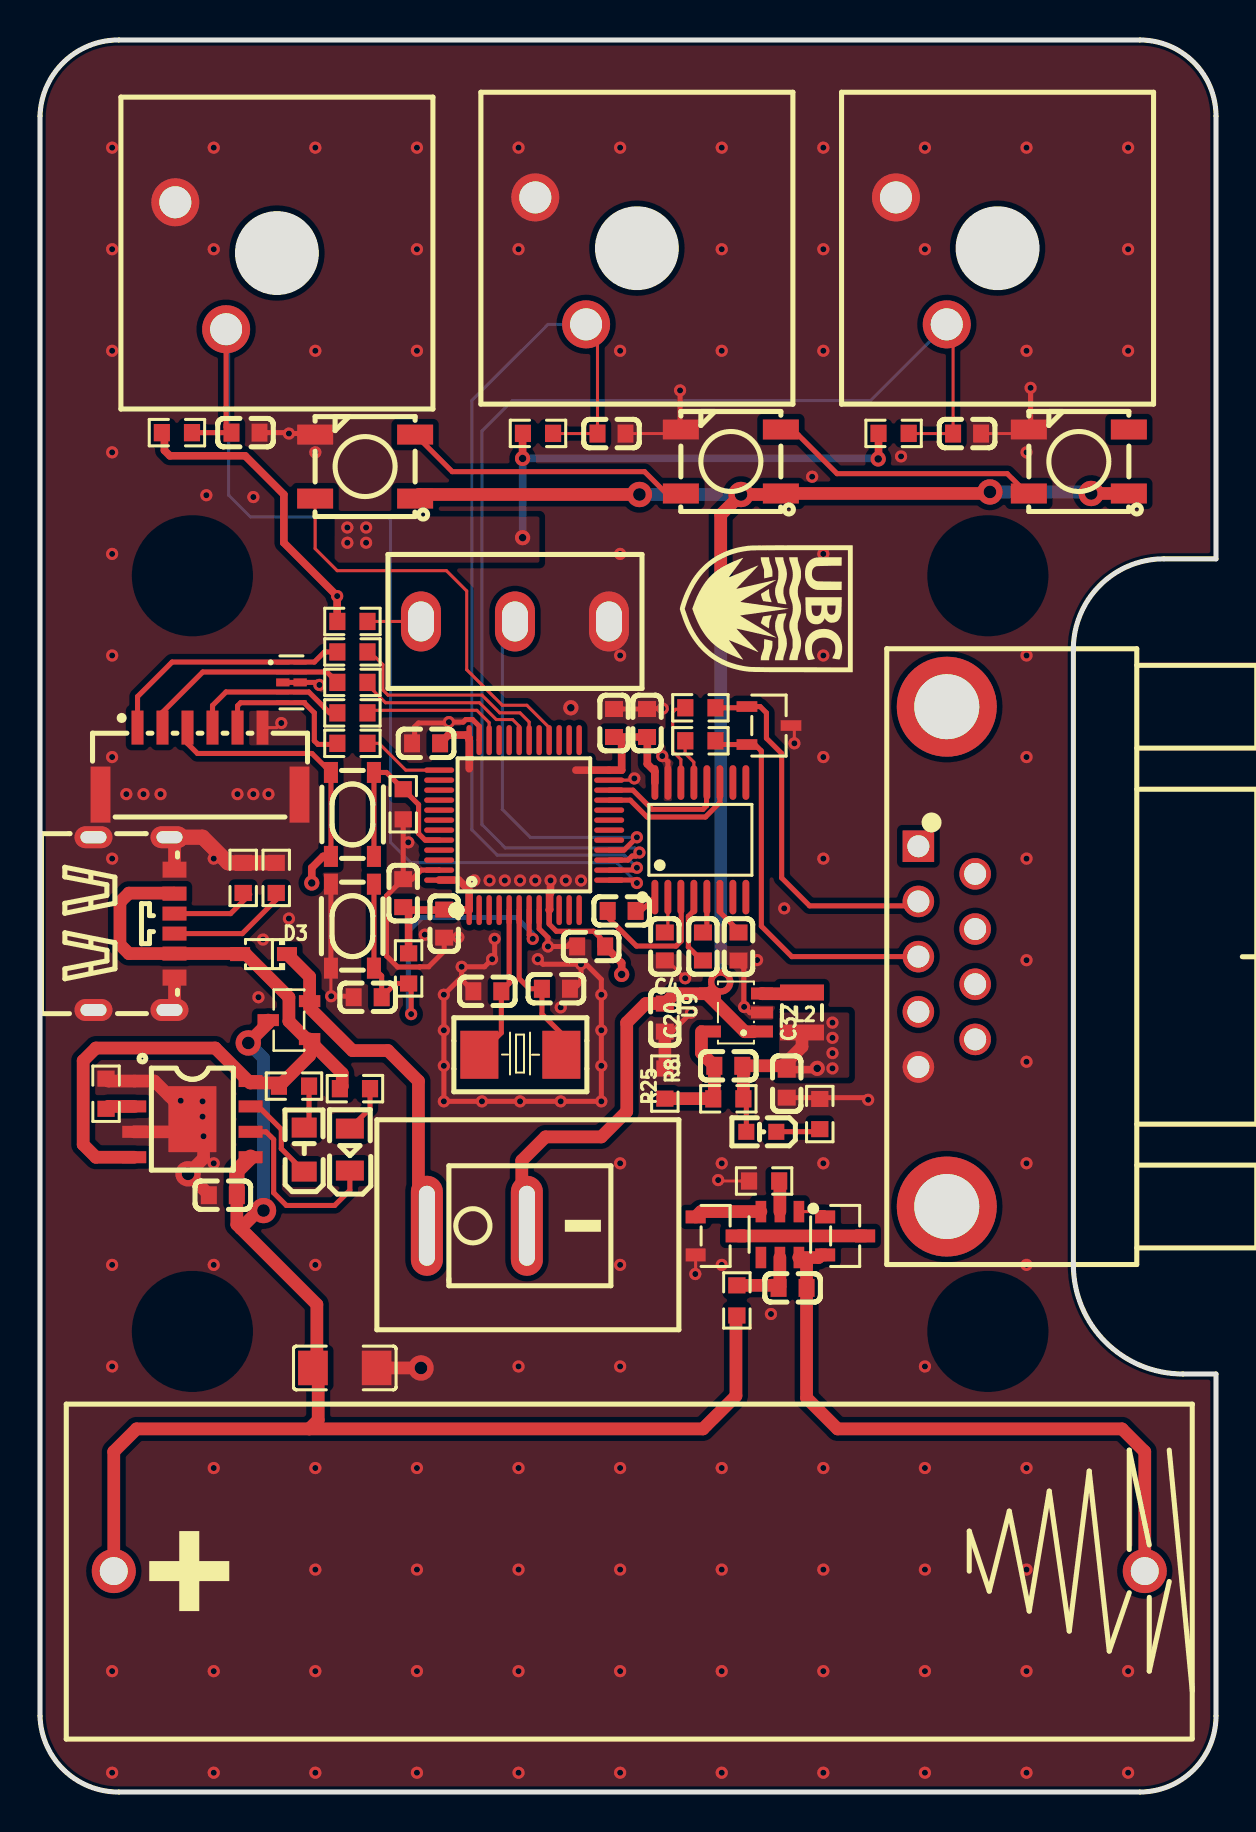
[diagram p1: board, top side]
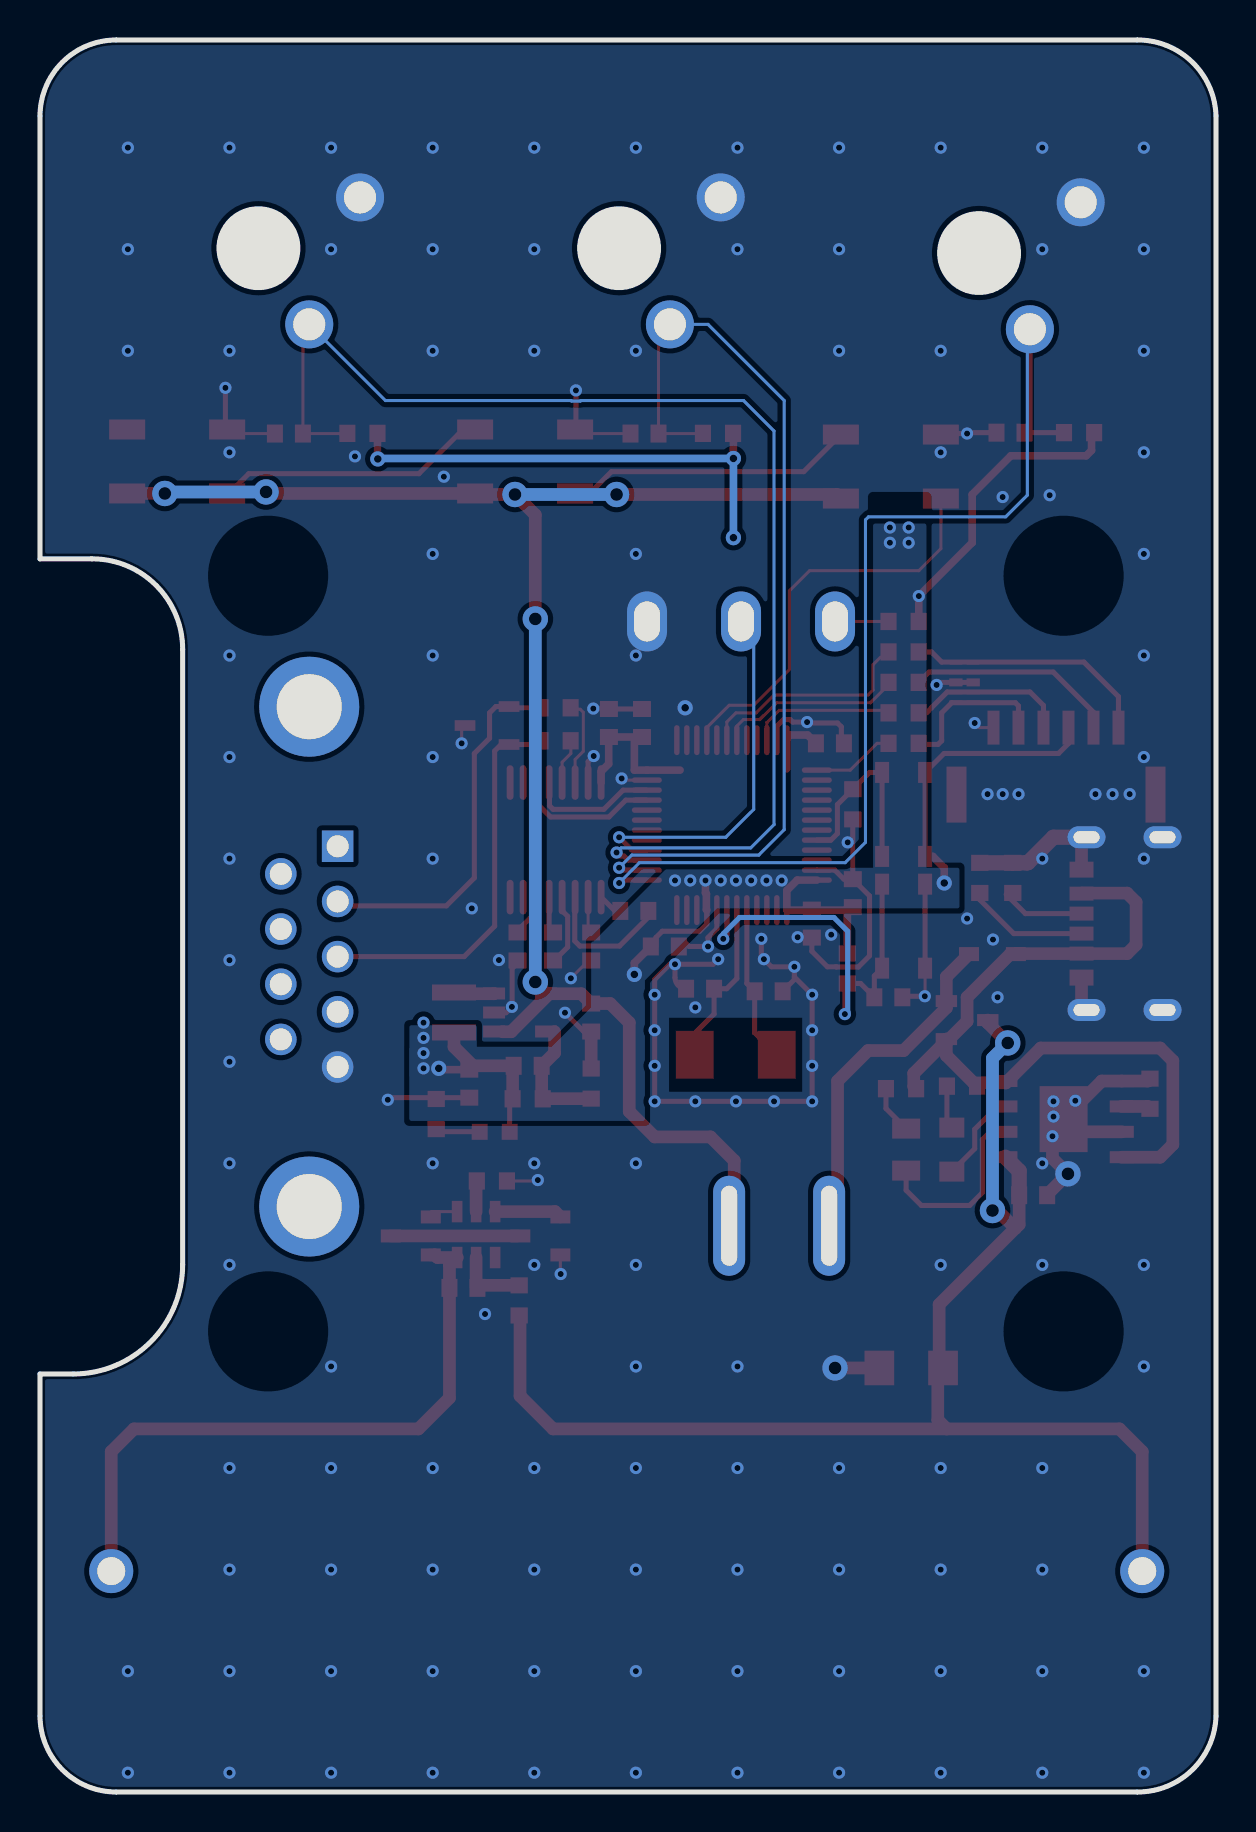
[diagram p2: board, bottom side, seen from below]

Outline 58.8 x 87.63 mm; copper layers: Top Layer, Bottom Layer. Coordinates in mm from the lower left corner of the outline.
Outline path: 0,83.82 arc(1.19,86.53) 3.94,87.63 54.99,87.63 arc(57.69,86.51) 58.8,83.82 58.8,61.68 56.2,61.68 arc(52.99,60.35) 51.67,57.15 51.67,26.38 arc(53.27,22.51) 57.14,20.91 58.8,20.91 58.8,3.81 arc(57.69,1.12) 54.99,0 3.94,0 arc(1.19,1.1) 0,3.81 0,83.82
Stack: Top Layer 0.035mm / Dielectric1 1.51mm FR4 er 4.5 / Bottom Layer 0.035mm

## Design rules (mm)
spacing copperThickness1oz (default): track to track 0.102, other pairs 0.152 to 0.3
spacing copperThickness2oz: track to track 0.203, other pairs 0.152 to 0.3
track width copperThickness1oz (default): min 0.127, default 0.152, max 2.54
track width copperThickness2oz: min 0.203, default 0.254, max 2.54
differential pair differentialPair (default): width min 0.127, default 0.254, max 2.54; gap min 0.152, default 0.152
net GND uses copperRegion
net +3.3V uses copperRegion

## Placement (name value [footprint] x y rotation side)
BAT1  BH-AA-A1AJ020  [BAT-TH_L56.3-W16.8-P51.55_BH-AA-A1AJ020]  29.46 11.05 180 top
C1  100nF  [C0603]  19.3 52.45 0 top
C3  33pF  [C0603]  22.37 40.05 0 top
C4  10uF  [C0603]  31.24 38.73 90 top
C5  47uF  [C1206]  15.24 21.21 180 top
C6  100nF  [C0603]  18.16 44.96 270 top
C7  100nF  [C0603]  20.21 43.43 90 top
C8  100nF  [C0603]  27.56 42.29 0 top
C9  100nF  [C0603]  28.7 53.47 270 top
C10  100nF  [C0603]  10.28 67.99 180 top
C11  100nF  [C0603]  28.58 67.94 180 top
C12  100nF  [C0603]  46.36 67.94 180 top
C13  33pF  [C0603]  25.8 40.18 180 top
C14  100nF  [C0603]  16.38 39.75 0 top
C15  100nF  [C0603]  30.35 53.47 90 top
C16  100nF  [C0603]  29.08 44.07 180 top
C17  100nF  [C0603]  31.24 42.29 90 top
C18  100nF  [C0603]  34.92 42.29 90 top
C19  100nF  [C0603]  33.15 42.29 270 top
C20  22pF  [C0603]  34.42 36.32 180 top
C21  10uF  [C0603]  9.14 29.85 0 top
C22  100nF  [C0603]  37.63 25.21 180 top
C32  10uF  [C0603]  37.34 35.43 90 top
D1  RCLAMP0524P  [DFN2510-10_L2.5-W1.0-P0.50-BL]  12.57 55.5 270 top
D3  1N5819WS  [SOD-323_L1.8-W1.3-LS2.5-RD]  11.18 41.91 180 top
D4  PSM712-LF-T7  [SOT-23-3_L3.0-W1.7-P0.95-LS2.9-BR]  36.45 53.34 180 top
DSUB2  D-DMR009PF-D002  [DSUB-TH_DMR-9S]  45.34 41.78 0 top
L2  2.2uH  [IND-SMD_L2.5-W2.0_MHCHL2520]  38.1 38.99 270 top
LED1  KT-0603R  [LED-SMD_L1.6-W0.8-R-RD]  36.07 33.02 180 top
LED2  KT-0805G  [LED0805-R-RD]  15.49 32.13 90 top
LED3  NCD0805R1  [LED0805-RD]  13.21 32.13 90 top
LED4  WS2812B-V5/W  [LED-SMD_4P-L5.0-W5.0-TL-1]  16.26 66.29 180 top
LED5  WS2812B-V5/W  [LED-SMD_4P-L5.0-W5.0-TL-1]  34.54 66.55 180 top
LED6  WS2812B-V5/W  [LED-SMD_4P-L5.0-W5.0-TL-1]  51.94 66.55 180 top
Q1  HL3400  [SOT-23-3_L2.9-W1.3-P1.90-LS2.4-BR]  40.26 27.81 180 top
Q2  HL6042  [SOT-23-3_L2.9-W1.4-P1.90-LS2.5-BR]  12.45 38.61 0 top
Q3  HL3400  [SOT-23-3_L2.9-W1.3-P1.90-LS2.4-BR]  33.78 27.81 180 top
R1  5.1kΩ  [R0603]  10.16 45.72 90 top
R2  5.1kΩ  [R0603]  11.81 45.72 270 top
R3  1kΩ  [R0603]  38.99 33.91 270 top
R4  10kΩ  [R0603]  6.85 67.99 180 top
R5  10kΩ  [R0603]  24.9 67.95 180 top
R6  10kΩ  [R0603]  42.68 67.95 180 top
R7  1kΩ  [R0603]  18.16 49.4 270 top
R8  150kΩ  [R0603]  34.42 34.67 180 top
R9  1kΩ  [R0603]  18.43 41.19 90 top
R10  2.4kΩ  [R0603]  3.3 34.92 270 top
R11  33Ω  [R0603]  15.62 57.02 180 top
R12  33Ω  [R0603]  15.62 55.5 180 top
R13  33Ω  [R0603]  15.62 53.97 180 top
R14  5.1kΩ  [R0603]  12.7 35.31 0 top
R15  33Ω  [R0603]  15.62 52.45 180 top
R16  5.1kΩ  [R0603]  15.75 35.18 0 top
R17  10kΩ  [R0603]  15.62 58.55 180 top
R18  1kΩ  [R0603]  36.21 30.56 0 top
R19  100Ω  [R0603]  34.84 24.59 90 top
R20  33Ω  [R0603]  33.02 54.23 0 top
R21  33Ω  [R0603]  33.02 52.58 0 top
R25  33kΩ  [R0603]  31.24 35.43 90 top
SW1  SKRPACE010  [KEY-SMD_4P-L4.2-W3.2-P2.20-LS4.6]  15.62 43.31 270 top
SW2  SKRPACE010  [KEY-SMD_4P-L4.2-W3.2-P2.20-LS4.6]  15.62 48.89 90 top
SW3  SS-12D10L5  [SW-TH_SS-12D10L5]  23.75 58.55 0 top
SW4  HX KCD11-2P-R  [SW-TH_2P-L15.0-W10.5-P5.00_KCD11-2P-R]  21.84 28.32 0 top
U1  STM32F103C8T6  [LQFP-48_L7.0-W7.0-P0.50-LS9.0-BL]  24.21 48.36 0 top
U3  CPG151101D13  [KEY-TH_CPG151101D21X]  8.04 76.34 90 top
U4  CPG151101D13  [KEY-TH_CPG151101D21X]  26.04 76.58 90 top
U5  CPG151101D13  [KEY-TH_CPG151101D21X]  44.07 76.58 90 top
U6  WAFER-GH1.25-6PLB  [CONN-SMD_6P-P1.25_XUNPU_WAFER-GH1.25-6PLB]  8 51.56 0 top
U7  SP3232EEY-L/TR  [TSSOP-16_L5.0-W4.4-P0.65-LS6.4-BL]  33.02 47.62 0 top
U8  TP4056  [ESOP-8_L4.9-W3.9-P1.27-LS6.0-BL-EP]  7.62 33.65 270 top
U9  LP3220SAB5F  [SOT-23-5_L3.0-W1.7-P0.95-LS2.8-BR]  34.8 38.99 0 top
U10  DW01  [SOT-23-6_L2.9-W1.6-P0.95-LS2.8-BL]  36.99 27.88 180 top
USB2  TYPE-C 6P  [TYPE-C-SMD_TYPE-C-6P_1]  4.7 43.43 270 top
X1  8MHz  [CRYSTAL-SMD_L5.0-W3.2]  24.02 36.87 180 top

## Footprints (pads in the part's own frame, mm; a bottom-side part is the same pattern mirrored in y, then rotated)
BAT-TH_L56.3-W16.8-P51.55_BH-AA-A1AJ020
  round 2.2 hole 1.4: 1(-25.775,0) 2(25.775,0)
C0603
  rect 0.8x0.9 smd: 1(-0.7,0) 2(0.7,0)
C1206
  rect 1.485x1.728 smd: 1(-1.593,0) 2(1.593,0)
CONN-SMD_6P-P1.25_XUNPU_WAFER-GH1.25-6PLB
  rect 0.6x1.7 smd: 1(-3.125,1.675) 2(-1.875,1.675) 3(-0.625,1.675) 4(0.625,1.675) 5(1.875,1.675) 6(3.125,1.675)
  rect 1x2.8 smd: 7(4.975,-1.675) 8(-4.975,-1.675)
CRYSTAL-SMD_L5.0-W3.2
  rect 1.9x2.4 smd: 1(-2.05,0) 2(2.05,0)
DFN2510-10_L2.5-W1.0-P0.50-BL
  rect 0.2x0.665 smd: 1(-1,-0.433) 2(-0.5,-0.433) 4(0.5,-0.433) 5(1,-0.433) 6(1,0.433) 7(0.5,0.433) 9(-0.5,0.433) 10(-1,0.433)
  rect 0.4x0.665 smd: 3(0,-0.433) 8(0,0.433)
DSUB-TH_DMR-9S
  rect 1.575x1.575 hole 1.1: 1(-1.42,5.52)
  round 1.575 hole 1.1: 2(-1.42,2.76) 3(-1.42,0) 4(-1.42,-2.76) 5(-1.42,-5.52) 6(1.42,4.14) 7(1.42,1.38) 8(1.42,-1.38) 9(1.42,-4.14)
  round 5 hole 3.25: 10(0,12.5) 11(0,-12.5)
ESOP-8_L4.9-W3.9-P1.27-LS6.0-BL-EP
  rect 0.6x1.2 smd: 1(-1.905,-2.909) 2(-0.635,-2.909) 3(0.635,-2.909) 4(1.905,-2.909) 5(1.905,2.909) 6(0.635,2.909) 7(-0.635,2.909) 8(-1.905,2.909)
  rect 3.3x2.4 smd: 9(0,0)
IND-SMD_L2.5-W2.0_MHCHL2520
  rect 0.8x2.2 smd: 1(-1,0) 2(1,0)
KEY-SMD_4P-L4.2-W3.2-P2.20-LS4.6
  rect 1.05x0.7 smd: 1(-2.1,1.075) 2(2.1,1.075) 3(-2.1,-1.075) 4(2.1,-1.075)
KEY-TH_CPG151101D21X
  round 2.4 hole 1.6: 1(-3.175,-1.27) 2(3.175,1.27)
LED0805-R-RD
  rect 1x1.399 smd: 1(1.05,0) 2(-1.05,0)
LED0805-RD
  rect 1x1.25 smd: 1(-1.1,0) 2(1.1,0)
LED-SMD_4P-L5.0-W5.0-TL-1
  rect 1.8x1 smd: 1(-2.5,1.6) 2(-2.5,-1.6) 3(2.5,-1.6) 4(2.5,1.6)
LED-SMD_L1.6-W0.8-R-RD
  rect 0.8x0.8 smd: 1(0.75,0) 2(-0.75,0)
LQFP-48_L7.0-W7.0-P0.50-LS9.0-BL
  oval 0.27x1.5 smd: 1(-2.75,-4.25) 2(-2.25,-4.25) 3(-1.75,-4.25) 4(-1.25,-4.25) 5(-0.75,-4.25) 6(-0.25,-4.25) 7(0.25,-4.25) 8(0.75,-4.25) 9(1.25,-4.25) 10(1.75,-4.25) 11(2.25,-4.25) 12(2.75,-4.25) 25(2.75,4.25) 26(2.25,4.25) 27(1.75,4.25) 28(1.25,4.25) 29(0.75,4.25) 30(0.25,4.25) 31(-0.25,4.25) 32(-0.75,4.25) 33(-1.25,4.25) 34(-1.75,4.25) 35(-2.25,4.25) 36(-2.75,4.25)
  oval 1.5x0.27 smd: 13(4.25,-2.75) 14(4.25,-2.25) 15(4.25,-1.75) 16(4.25,-1.25) 17(4.25,-0.75) 18(4.25,-0.25) 19(4.25,0.25) 20(4.25,0.75) 21(4.25,1.25) 22(4.25,1.75) 23(4.25,2.25) 24(4.25,2.75) 37(-4.25,2.75) 38(-4.25,2.25) 39(-4.25,1.75) 40(-4.25,1.25) 41(-4.25,0.75) 42(-4.25,0.25) 43(-4.25,-0.25) 44(-4.25,-0.75) 45(-4.25,-1.25) 46(-4.25,-1.75) 47(-4.25,-2.25) 48(-4.25,-2.75)
R0603
  rect 0.806x0.864 smd: 1(-0.753,0) 2(0.753,0)
SOD-323_L1.8-W1.3-LS2.5-RD
  rect 1x0.7 smd: 1(-1.173,0) 2(1.173,0)
SOT-23-3_L2.9-W1.3-P1.90-LS2.4-BR
  rect 1x0.65 smd: 1(1,-0.95) 2(1,0.95) 3(-1,0)
SOT-23-3_L2.9-W1.4-P1.90-LS2.5-BR
  rect 1.07x0.6 smd: 1(1.035,-0.95) 2(1.035,0.95) 3(-1.035,0)
SOT-23-3_L3.0-W1.7-P0.95-LS2.9-BR
  rect 1.038x0.532 smd: 1(1.101,-0.95) 2(1.101,0.95) 3(-1.101,0)
SOT-23-5_L3.0-W1.7-P0.95-LS2.8-BR
  rect 1.1x0.6 smd: 1(1.3,-0.95) 2(1.3,0) 3(1.3,0.95) 4(-1.3,0.95) 5(-1.3,-0.95)
SOT-23-6_L2.9-W1.6-P0.95-LS2.8-BL
  rect 0.532x1.072 smd: 1(-0.95,-1.149) 2(0,-1.149) 3(0.95,-1.149) 4(0.95,1.149) 5(0,1.149) 6(-0.95,1.149)
SW-TH_2P-L15.0-W10.5-P5.00_KCD11-2P-R
  oval 1.6x5 hole 0.8x4: 1(-2.5,0) 2(2.5,0)
SW-TH_SS-12D10L5
  oval 2x3 hole 1.3x2: 1(-4.7,0) 2(0,0) 3(4.7,0)
TSSOP-16_L5.0-W4.4-P0.65-LS6.4-BL
  oval 0.343x1.732 smd: 1(-2.275,-2.866) 2(-1.625,-2.866) 3(-0.975,-2.866) 4(-0.325,-2.866) 5(0.325,-2.866) 6(0.975,-2.866) 7(1.625,-2.866) 8(2.275,-2.866) 9(2.275,2.866) 10(1.625,2.866) 11(0.975,2.866) 12(0.325,2.866) 13(-0.325,2.866) 14(-0.975,2.866) 15(-1.625,2.866) 16(-2.275,2.866)
TYPE-C-SMD_TYPE-C-6P_1
  oval 1.1x1.9 hole 0.6x1.3: 7(-4.32,1.775) 7(-4.32,-2.025) 7(4.32,1.775) 7(4.32,-2.025)
  rect 0.7x1.2 smd: A5(-0.5,2.025) A9(1.5,2.025) B5(0.5,2.025) B9(-1.5,2.025)
  rect 0.8x1.2 smd: A12(2.7,2.025) B12(-2.7,2.025)

## Nets
As in the schematic.

Pads without a net: DSUB2 1 4 6 7 8 9 10 11; LED6 2; U1 2 3 4 10 11 12 17 18 19 20 25 26 27 29 32 33 38 39 40 41 42 43 45 46; U7 7 8 9 10; U10 4

## Via types
v1: diameter 0.762, hole 0.381, Top Layer to Bottom Layer, 7 vias
v2: diameter 0.61, hole 0.305, Top Layer to Bottom Layer, 182 vias
v3: diameter 1.27, hole 0.635, Top Layer to Bottom Layer, 10 vias

## Routing (per net, layer and track width the routed paths; a pad name or vN(x,y) marks a point on that pad's centre or on a via; arc(x,y) is an arc through that point)
+3.3V: length 90.6
  Top Layer w0.254: SW2.1 SW2.2 13.6,51.94 7.87,51.94 7.38,52.44 U6.3 ; R8.1 35.32,34.52 LED1.1 ; U1.9 25.46,43.41 25.82,43.05 27.69,43.05 28.01,42.73 28.01,42.29
  Top Layer w0.381: 18.31,44.11 C6.2 ; 18.31,44.11 18.43,43.99 18.43,41.95 ; 18.31,44.11 U1.1 21.46,45.09 20.94,45.61 U1.48 ; 26.8,51.11 U1.24 29.08,51.11 29.08,52.7 29.02,52.77 ; 29.02,52.77 C9.2 ; 29.02,52.77 C15.1 30.37,52.75 30.37,51.42 30.74,51.04 U7.16 ; U1.9 25.48,44.13 25.48,44.92 25.53,44.97 v2(25.53,45.59) ; C1.2 20.42,52.87 21.3,52.87 21.46,52.71 U1.36 ; R4.2 6.22,67.86 6.22,67.1 6.49,66.83 10.26,66.83 12.19,64.9 12.19,62.48 v2(14.86,59.82) 14.86,58.56 R17.2 ; 21.46,52.61 21.46,51.18 ; v1(38.86,36.19) 38.8,36.13 C32.2 ; C8.2 29.08,41.47 v1(29.08,40.89) ; v1(41.91,66.67) 41.93,66.69 41.93,67.95 ; SW2.1 14.16,46.79 13.59,46.23 v1(13.59,45.47) ; 24.15,67.95 24.13,67.94 v1(24.13,66.7)
  Top Layer w0.635: R8.1 35.17,36.27 35.12,36.32 37.15,36.32 38.1,37.27 38.1,37.99 37.6,37.99
  Bottom Layer w0.381: v1(24.13,62.74) v1(24.13,66.7) 41.89,66.7 v1(41.91,66.67)
  vias: v2(15.37,63.25) v2(15.37,62.48) v2(16.31,63.25) v2(16.31,62.48) v2(21.72,45.59) v2(22.48,45.59) v2(23.24,45.59) v2(24,45.59) v2(24.77,45.59) v2(26.29,45.59) v2(27.05,45.59) v2(39.62,38.48) v2(39.62,37.72) v2(39.62,36.96) v2(39.62,36.19)
GND: length 118.4
  Top Layer w0.152: C12.1 49.24,67.94 49.44,68.15 ; U6.6 11.83,53.24 v2(12.07,53.47) ; D4.3 37.72,53.17 v2(37.72,52.45) ; C17.1 31.37,41.59 v2(32.26,40.7) ; v2(32.77,25.91) 32.78,25.92 Q3.2 ; v2(29.72,50.69) 29.63,50.61 U1.23 ; SW1.4 14.55,39.81 v2(14.56,39.8) ; v2(33.91,30.61) 33.95,30.56 35.45,30.56 ; C11.1 31.84,67.94 32.04,68.15
  Top Layer w0.254: v2(14.56,39.8) 15.51,39.8 15.68,39.62 ; 26.61,42.54 26.35,42.29 v2(25.4,42.29) 25.4,42.74 24.96,43.18 U1.8 ; 12.01,55.5 13.84,55.5 v2(13.97,55.37) ; v2(35.21,39.27) 35.5,38.98 35.67,38.98 ; C6.1 R7.2 ; C6.1 18.61,45.66 19.06,46.11 19.95,46.11 19.95,46.12 U1.47 ; C6.1 17.33,44.82 17.33,41.82 17.88,41.26 18.98,41.26 18.99,41.27 19.43,41.27 20.21,42.05 C7.1 ; 6.87,34.41 v2(7.03,34.58) ; v2(41.41,34.62) 41.3,34.73 C32.1 ; 21.08,40.77 v2(20.19,39.88) v2(20.19,38.1) v2(20.19,36.32) v2(20.19,34.54) v2(22.1,34.54) v2(24,34.54) v2(26.04,34.54) v2(28.07,34.54) v2(28.07,36.32) v2(28.07,38.1) v2(28.07,39.88) 28.07,40.64 27.3,41.4 v2(27.05,41.4) ; 21.08,40.77 v2(21.08,41.27) 22.23,41.27 v2(22.61,41.66) 22.73,41.78 v2(22.73,42.67) ; 21.08,40.77 21.08,40.64 C3.1 ; SW1.3 SW1.4 ; U1.35 21.97,52.62 21.97,53.3 21.63,53.64 21.29,53.64 21.16,53.51 v2(20.45,53.51) 20.4,53.47 18.92,53.47 18.73,53.27 18.73,52.45 ; v2(27.05,41.4) 27.05,40.73 arc(26.89,40.34) C13.1 ; v2(27.05,41.4) 25.15,41.4 v2(24.89,41.66) ; C10.1 12.4,67.99 v2(12.45,67.94) 13.7,67.94 LED4.3 ; U7.15 31.39,51.54 v2(31.11,51.82) ; v2(49.53,70.23) 49.53,68.31 49.82,68.02 ; C4.1 31.61,38.03 v2(32.55,38.98) ; C9.1 C15.2 30.38,54.19 v2(31.14,54.19) ; 35.18,39.3 35.18,39.42 35.19,39.44 35.19,41.2 34.92,41.46 C18.1 ; v2(32,70.1) 32,68.11
  Top Layer w0.635: v2(8.18,32.8) 8.18,31.7 v3(7.4,30.92) 8.44,29.88 C21.1 ; USB2.A12 6.72,39.36 6.47,39.11 ; 4.71,33.02 6.98,33.02 U8.9 5.72,35.56 U8.1 3.42,35.56 R10.1 ; C5.1 v3(19.05,21.21) ; R25.2 C4.1 ; USB2.7 6.72,47.5 6.72,46.13
  Top Layer w0.762: R2.1 R1.2 9.48,46.47 9.47,46.48 9.4,46.48 8.13,47.75 USB2.7
  vias: v1(26.54,54.23) v2(3.61,82.24) v2(3.61,77.16) v2(3.61,72.08) v2(3.61,67) v2(3.61,61.92) v2(3.61,56.84) v2(3.61,51.76) v2(3.61,46.68) v2(3.61,26.36) v2(3.61,21.28) v2(3.61,6.04) v2(3.61,0.97) v2(4.32,49.91) v2(5.17,49.91) v2(6.03,49.91) v2(8.13,34.54) v2(8.13,33.78) v2(8.32,64.86) v2(8.69,82.24) v2(8.69,77.16) v2(8.69,46.68) v2(8.69,31.44) v2(8.69,26.36) v2(8.69,16.2) v2(8.69,11.12) v2(8.69,6.04) v2(8.69,0.97) v2(9.87,49.91) v2(10.67,64.77) v2(10.67,49.91) v2(10.92,39.75) v2(11.15,42.64) v2(11.42,49.91) v2(12.45,43.69) v2(13.77,82.24) v2(13.77,72.08) v2(13.77,67) v2(13.77,26.36) v2(13.77,16.2) v2(13.77,11.12) v2(13.77,6.04) v2(13.77,0.97) v2(18.42,47.5) v2(18.85,82.24) v2(18.85,77.16) v2(18.85,72.08) v2(18.85,16.2) v2(18.85,11.12) v2(18.85,6.04) v2(18.85,0.97) v2(19.24,42.88) v2(20.92,42.75) v2(23.93,82.24) v2(23.93,77.16) v2(23.93,21.28) v2(23.93,16.2) v2(23.93,11.12) v2(23.93,6.04) v2(23.93,0.97) v2(26.04,39.24) v2(29.01,82.24) v2(29.01,72.08) v2(29.01,61.92) v2(29.01,56.84) v2(29.01,31.44) v2(29.01,26.36) v2(29.01,21.28) v2(29.01,16.2) v2(29.01,11.12) v2(29.01,6.04) v2(29.01,0.97) v2(34.09,82.24) v2(34.09,77.16) v2(34.09,72.08) v2(34.09,31.44) v2(34.09,26.36) v2(34.09,16.2) v2(34.09,11.12) v2(34.09,6.04) v2(34.09,0.97) v2(35.85,41.61) v2(36.55,23.91) v2(37.21,44.2) v2(38.61,65.79) v2(39.17,82.24) v2(39.17,77.16) v2(39.17,72.08) v2(39.17,61.92) v2(39.17,56.84) v2(39.17,51.76) v2(39.17,46.68) v2(39.17,31.44) v2(39.17,16.2) v2(39.17,11.12) v2(39.17,6.04) v2(39.17,0.97) v2(43.05,66.8) v2(44.25,82.24) v2(44.25,77.16) v2(44.25,21.28) v2(44.25,16.2) v2(44.25,11.12) v2(44.25,6.04) v2(44.25,0.97) v2(49.33,82.24) v2(49.33,72.08) v2(49.33,67) v2(49.33,56.84) v2(49.33,51.76) v2(49.33,46.68) v2(49.33,41.6) v2(49.33,36.52) v2(49.33,31.44) v2(49.33,26.36) v2(49.33,16.2) v2(49.33,11.12) v2(49.33,6.04) v2(49.33,0.97) v2(54.41,82.24) v2(54.41,77.16) v2(54.41,72.08) v2(54.41,6.04) v2(54.41,0.97)
VBAT: length 70
  Top Layer w0.635: v3(11.18,29.08) 10.92,29.08 10.03,28.19 ; 11.41,38.61 11.41,38.46 v3(10.41,37.46) ; 13.46,18.16 4.83,18.16 3.69,17.02 BAT1.2 ; 13.46,18.16 13.91,18.61 13.91,20.95 C5.2 13.84,21.4 13.84,24.38 10.03,28.19 ; 13.46,18.16 33.15,18.16 34.8,19.81 34.8,23.79 R19.1 ; 10.03,28.19 9.84,28.38 C21.2
  Top Layer w0.762: C21.2 9.84,31.06 U8.5
  Bottom Layer w0.635: v3(10.41,37.46) 11.18,36.7 v3(11.18,29.08)
_CC1: length 4.2
  Top Layer w0.254: 10.49,44.89 9.53,43.93 USB2.A5
_CC2: length 6.1
  Top Layer w0.254: USB2.B5 10.11,42.93 11.81,44.63 R2.2
_RS232_RX: length 18.8
  Top Layer w0.254: R20.2 35.29,54.23 D4.1 36.01,54.29 36.32,53.97 36.32,52.7 37.08,51.94 37.08,45.72 38.48,44.32 43.7,44.32 43.92,44.54
_RS232_TX: length 19.8
  Top Layer w0.254: 43.92,41.78 37.59,41.78 36.07,43.31 36.07,52.07 35.75,52.39 D4.2 33.96,52.39 R21.2
_VBUS: length 41
  Top Layer w0.635: USB2.B9 6.7,44.96 4.44,44.96 4,44.51 4,42.38 4.44,41.93 USB2.A9 9.98,41.93 D3.2 10.29,41.91 12.45,39.75 12.45,38.55 13.34,37.66 Q2.1 13.48,37.57 ; 13.48,37.57 13.48,36.83 12.11,35.47 10.51,35.47 8.76,37.21 2.79,37.21 2.16,36.58 2.16,32.38 2.79,31.75 U8.4 ; 13.48,37.57 15.11,35.94 15.11,35.3 R16.1
_VBUS_OUT: length 83.1
  Top Layer w0.635: 24.09,28.32 24.09,31.58 25.27,32.77 28.07,32.77 29.34,34.04 29.34,38.48 30.29,39.43 C4.2 31.73,39.93 33.34,39.93 35.24,38.03 35.67,38.03 ; v3(34.04,58.67) 34.04,63.88 v3(35.05,64.9) 36.99,64.9 LED5.1 47.42,64.95 v3(47.5,65.02) ; v3(29.97,64.9) 18.96,64.9 18.76,64.69 ; U9.4 34.04,40.48 v3(34.04,40.51) ; v3(52.56,64.95) LED6.1
  Bottom Layer w0.635: v3(34.04,40.51) v3(34.04,58.67) ; v3(47.5,65.02) 52.48,65.02 v3(52.56,64.95) ; v3(29.97,64.9) v3(35.05,64.9)
_VBUS_SAFE: length 17.6
  Top Layer w0.635: D3.1 13.48,40.78 Q2.2 13.48,39.22 15.62,37.08 17.4,37.08 18.92,35.56 18.92,29 19.6,28.32
BAT_CHARGING: length 4.6
  Top Layer w0.254: LED3.1 12.07,32.17 12.07,33.15 10.92,34.29 U8.7
BAT_READY: length 9.4
  Top Layer w0.254: LED2.2 15.49,30.1 14.73,29.34 12.32,29.34 11.68,29.97 11.68,32.64 11.3,33.02 10.53,33.02
BOOT0: length 9.7
  Top Layer w0.254: SW2.3 SW2.4 17.32,50.99 R7.1 18.93,49.39 18.93,47.94 19.26,47.61 U1.44
BULLET_SWITCH: length 18.6
  Top Layer w0.254: v2(29.85,47.75) 29.2,47.11 U1.16
  Bottom Layer w0.152: SW3.2 23.11,57.91 23.11,49.15 24.51,47.75 v2(29.85,47.75)
LED1_OUT: length 14.6
  Top Layer w0.254: 32.04,64.69 31.57,64.69 30.23,66.04 20.61,66.04 LED4.2
LED2_OUT: length 14.1
  Top Layer w0.254: 49.82,64.82 49.48,64.82 48.36,65.94 39.85,65.94 37.9,67.89 37.04,67.89
NRST: length 21.9
  Top Layer w0.254: SW1.1 SW1.2 17.08,40.82 C14.2 17.77,40.44 18.56,40.44 v2(18.56,38.91) ; v2(24.64,42.67) 24.46,42.85 U1.7
  Bottom Layer w0.254: v2(24.64,42.67) 24.64,42.93 23.82,43.74 19.1,43.74 18.42,43.05 18.42,39.05 v2(18.56,38.91)
PA3: length 55
  Top Layer w0.254: U3.1 9.31,68.26 C10.2 R4.1 ; U1.13 29.7,45.61 v2(29.85,45.47)
  Bottom Layer w0.152: U3.1 9.43,73.04 9.43,64.86 10.52,63.78 17.37,63.78 17.53,63.63 17.53,47.5 18.54,46.48 28.83,46.48 v2(29.85,45.47)
PA4: length 47.2
  Top Layer w0.152: U4.1 27.87,72.84 27.87,67.94 25.66,67.94 R5.1
  Top Layer w0.254: U1.14 29.73,46.11 v2(29.85,46.23)
  Bottom Layer w0.152: U4.1 25.4,73.41 21.59,69.6 21.59,48.13 22.86,46.86 29.21,46.86 v2(29.85,46.23)
PA5: length 63.1
  Top Layer w0.152: U5.1 45.65,73.09 45.65,67.94 43.44,67.94 R6.1
  Top Layer w0.254: U1.15 29.4,46.61 29.6,46.81 29.79,46.81 v2(29.97,46.99)
  Bottom Layer w0.152: U5.1 41.53,69.6 32.25,69.6 32.23,69.57 31.78,69.57 31.76,69.6 23.62,69.6 22.1,68.07 22.1,48.39 23.27,47.22 29.74,47.22 v2(29.97,46.99)
RCC_OSC_IN: length 7.9
  Top Layer w0.254: X1.2 23.07,37.97 C3.2 23.46,40.44 U1.5
RCC_OSC_OUT: length 8.5
  Top Layer w0.254: U1.6 23.96,40.68 24.47,40.18 C13.2 25.1,38.91 26.07,37.94 X1.1
RS232_RX: length 4.4
  Top Layer w0.152: R20.1 32.19,54.15 31.79,54.15 31.64,54 31.64,52.05 32.05,51.64 U7.14
RS232_TX: length 2.3
  Top Layer w0.152: U7.13 32.7,51.51 32.26,51.94 32.26,52.57 R21.1
SPI2_MOSI(PB15): length 20.8
  Top Layer w0.152: 13.76,64.69 13.76,62.19 14.86,61.09 20.32,61.09 21.34,60.07 21.34,56.13 23.11,54.36 24.34,54.36 25.46,53.24 U1.28
SWCLK: length 4.1
  Top Layer w0.152: R15.1 16.95,52.45 18.29,51.11 U1.37
SWCLK_: length 7.8
  Top Layer w0.254: R15.2 14.82,52.4 13.9,52.4 13.72,52.58 13.72,53.97 13.21,54.48 10.03,54.48 9.88,54.33 U6.5
SWDIO: length 7.3
  Top Layer w0.152: U1.34 22.46,53.49 21.84,54.1 16.5,54.1 R13.1
SWDIO_: length 8.1
  Top Layer w0.254: R13.2 14.48,53.97 14.22,54.23 14.22,54.23 13.44,55.02 9.3,55.02 8.63,54.35 U6.4
USART1_RX: length 10.6
  Top Layer w0.254: U6.2 6.13,54 8.14,56.02 14.35,56.02 R12.2
USART1_RX(PA10): length 9.3
  Top Layer w0.152: R12.1 16.37,55.38 17.27,54.48 21.97,54.48 22.81,53.64 23.63,53.64 23.96,53.31 U1.31
USART1_TX: length 12.5
  Top Layer w0.254: U6.1 4.88,54.79 6.6,56.51 13.72,56.51 14.22,57.02 R11.2
USART1_TX(PA9): length 10.7
  Top Layer w0.152: U1.30 24.46,53.52 24,53.97 22.99,53.97 22.1,54.86 17.4,54.86 17.14,55.12 17.14,56.39 16.76,56.77
USART3_RX(PB11): length 6.5
  Top Layer w0.254: 33.35,50.49 33.33,50.47 33.33,49.33 33.15,49.15 30.61,49.15 29.64,50.11 U1.22
USART3_TX(PB10): length 7.2
  Top Layer w0.254: U1.21 29.51,49.61 30.35,48.77 33.27,48.77 33.99,49.49 U7.11
$1N16: length 2.2
  Top Layer w0.254: LED1.2 36.83,33.03 38.99,33.03
$1N89: length 1.6
  Top Layer w0.254: 29.53,43.94 29.93,43.94 U7.1
$1N90: length 7
  Top Layer w0.254: U7.3 32.06,44.74 32.06,42.57 31.81,42.31 29.82,42.31 28.13,44.01 28.13,44.07
$1N91: length 1.8
  Top Layer w0.152: C17.2 31.39,43.14 U7.2
$1N93: length 2.2
  Top Layer w0.254: 35,43 33.99,44.01 U7.6
$1N102: length 3.9
  Top Layer w0.254: U7.4 32.67,44.74 32.67,44.05 32.42,43.8 32.42,42.26 33.08,41.59 33.4,41.59
$1N103: length 1.8
  Top Layer w0.254: 33.35,44.76 33.35,43.05 33.4,42.99
$1N132: length 1.5
  Top Layer w0.635: R10.2 3.42,34.29 U8.2
$1N134: length 2.2
  Top Layer w0.254: LED3.2 13.45,33.48 R14.2
$1N138: length 2.4
  Top Layer w0.254: LED2.1 16.5,34.19 R16.2
$1N157: length 2.7
  Top Layer w0.152: SW3.1 R17.1
$1N185: length 1.5
  Top Layer w0.635: U10.2 36.99,30.53 R18.2
$1N186: length 1.4
  Top Layer w0.152: 39.3,28.96 39.22,29.03 U10.1
$1N187: length 3.4
  Top Layer w0.635: Q3.1 33.05,29.03 U10.3
$1N188: length 6.3
  Top Layer w0.635: Q1.3 34.93,27.81
$1N233: length 1.5
  Top Layer w0.635: 37.6,39.99 37.54,39.93 36.11,39.93 U9.3
$1N234: length 6.1
  Top Layer w0.635: 33.07,38.03 33.07,36.97 C20.2 33.72,34.72 R8.2 33.65,34.68 R25.1
$1N238: length 3.7
  Top Layer w0.635: U10.5 36.99,25.28 C22.2 36.8,25.34 34.84,25.34
$1N240: length 32.5
  Top Layer w0.635: 55.24,11.05 55.24,17.02 54.1,18.16 39.88,18.16 38.33,19.71 C22.1 38.33,26.35 U10.6 38.92,26.73 39.05,26.86 Q1.2

## Copper pours and planes (outline as drawn; the poured copper is in the pictures)
+3.3V on Top Layer: 40.46,38.99 40.46,35.72 36.95,35.72 36.96,38.99
+3.3V on Top Layer: 24.97,63.79 24.97,61.49 14.73,61.49 14.73,63.79
+3.3V on Top Layer: 20.88,51.7 27.51,51.7 27.51,45.05 20.88,45.05
+3.3V on Bottom Layer: 36.96,38.35 40.33,38.35 40.33,35.72 36.96,35.72
+3.3V on Bottom Layer: 14.48,64.77 17.14,64.77 17.14,44.24 14.55,44.24 14.48,44.31
+3.3V on Bottom Layer: 12.83,46.23 27.43,46.23 31.11,42.54 31.24,42.54 31.24,39.24 33.21,37.27 40.34,37.27 40.34,33.57 28.55,33.57 28.55,40.6 24.95,44.2 12.83,44.2
GND on Top Layer: 2.51,51.29 13.46,51.29 13.46,48.51 2.51,48.51
GND on Top Layer: -4.45,90.17 61.47,90.17 61.47,-2.16 -4.45,-2.16
GND on Bottom Layer: -11.81,90.3 69.47,90.3 69.47,-4.32 -11.81,-4.32
